# Altium project mcudevkit.PrjPcb (part 2 of 3)

## Sheet Usb to Uart.SchDoc
size A4; SheetNumber: 8; SheetTotal: 22
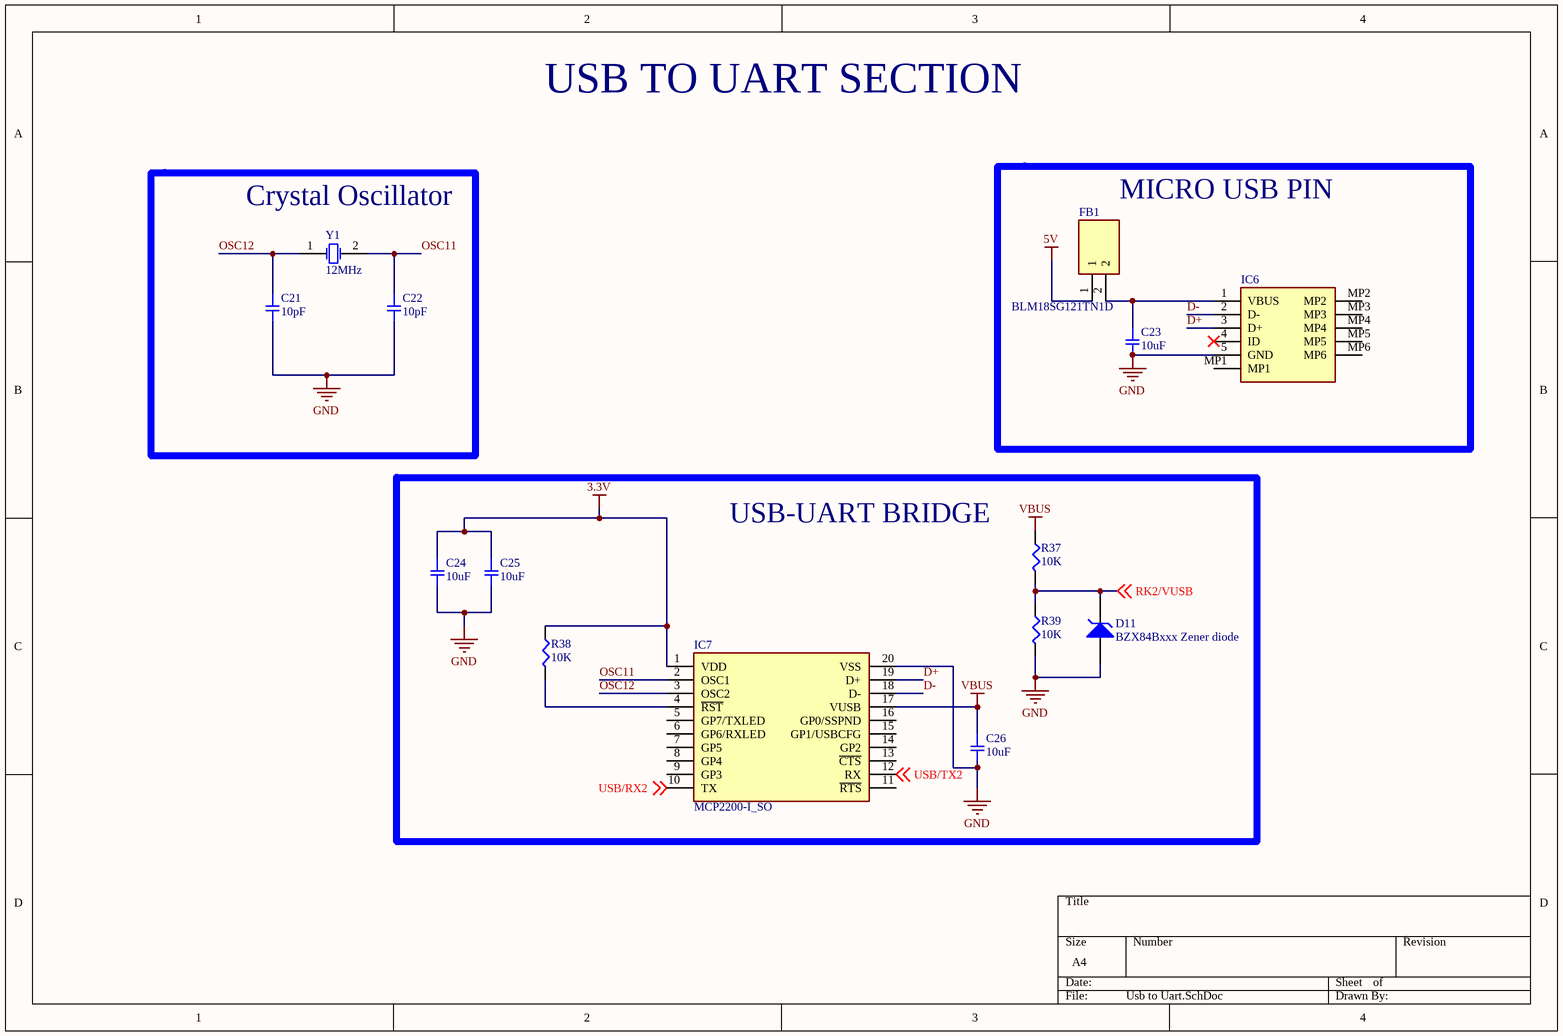
[diagram p7: Usb to Uart.SchDoc]

### Parts
C21  10pF  [SMD-0805C]
C22  10pF  [SMD-0805C]
C23  10uF  [SMD-0805C]
C24  10uF  [SMD-0805C]
C25  10uF  [SMD-0805C]
C26  10uF  [SMD-0805C]
D11  BZX84Bxxx Zener diode  [SOT95P240X120-3N]
FB1  BLM18SG121TN1D  [BLM18EG101TH1D]
IC6  (no value)  [0473461001]
IC7  MCP2200-I_SO  [SOIC127P1030X265-20N]
R37  10K  [SMD-0805-RES]
R38  10K  [SMD-0805-RES]
R39  10K  [SMD-0805-RES]
Y1  12MHz  [Mini Crystal]

### Blocks framed on the sheet
Crystal Oscillator: C21 C22 Y1
MICRO USB PIN: C23 FB1 IC6
USB-UART BRIDGE: C24-C26 D11 IC7 R37-R39

### Nets
3.3V: C24.1 C25.1 IC7.1(VDD) R38.1
5V: FB1.1
GND: C21.2 C22.2 C23.2 C24.2 C25.2 C26.2 D11.1(A) IC6.5(GND) IC7.20(VSS) R39.2
VBUS: C26.1 IC7.17(VUSB) R37.1
D+: IC6.3(D+) IC7.19(D+)
D-: IC6.2(D-) IC7.18(D-)
OSC11: C22.1 IC7.2(OSC1) Y1.2(X2)
OSC12: C21.1 IC7.3(OSC2) Y1.1(X1)
RK2/VUSB: D11.3(K) R37.2 R39.1 ; off-sheet RK2/VUSB
USB/RX2: IC7.10(TX) ; off-sheet USB/RX2
USB/TX2: IC7.12(RX) ; off-sheet USB/TX2
NetC23_1: C23.1 FB1.2 IC6.1(VBUS)
NetIC7_4: IC7.4(~{RST}) R38.2

Not connected (* = marked no-connect by the designer): IC6 4(ID)* MP1 MP2 MP3 MP4 MP5 MP6; IC7 5(GP7/TXLED) 6(GP6/RXLED) 7(GP5) 8(GP4) 9(GP3) 11(~{RTS}) 13(~{CTS}) 14(GP2) 15(GP1/USBCFG) 16(GP0/SSPND)

### Notes on the sheet
- USB TO UART SECTION

### Library data of the parts
C21-C26 = GCD21BR71H104KA01L: CAP CER 0.1UF 50V X7R 0805; Manufacturer: Murata Electronics North America; Factory Stock: 0; Unit Price (USD): 0.24; Minimum Quantity: 1; Value: 0.10µF; Tolerance: ±10%; Datasheets: http://www.murata.com/~/media/webrenewal/support/library/catalog/products/capacitor/mlcc/c03e.ashx; Image: //media.digikey.com/Renders/Murata%20Renders/0805%28GxM6%29.jpg; Digi-Key Part Number: 490-11955-1-ND; Part Number: GCD21BR71H104KA01L; Quantity Available: 157; @ qty: 0; Packaging: Cut Tape (CT); Series: GCD; Part Status: Active; Voltage: 50V; Temperature Coefficient: X7R; Operating Temperature: -55°C ~ 125°C; Features: -; Ratings: AEC-Q200; Applications: Automotive; Mounting Type: Surface Mount, MLCC; Package / Case: 0805 (2012 Metric); Size / Dimension: 0.079" L x 0.049" W (2.00mm x 1.25mm); Height - Seated (Max): -; Thickness (Max): 0.049" (1.25mm); Lead Spacing: -; Lead Style: -
D11 = BZX84Bxxx Zener diode: BZX84Bxxx SMD Zener Diode SOT-23
FB1 = BLM18SG121TN1D: Ferrite Bead; Manufacturer_Name: Murata Electronics; Datasheet Link: http://www.murata.com/~/media/webrenewal/support/library/catalog/products/emc/emifil/c31e.ashx?la=en-gb; Height: 0.75mm; Manufacturer_Part_Number: BLM18SG121TN1D; Mouser Part Number: 81-BLM18SG121TN1D; Mouser Price/Stock: https://www.mouser.co.uk/ProductDetail/Murata-Electronics/BLM18SG121TN1D?qs=OMB6gcCnelWdy%252B7xRA0fBw%3D%3D; Arrow Part Number: BLM18SG121TN1D; Arrow Price/Stock: https://www.arrow.com/en/products/blm18sg121tn1d/murata-manufacturing?region=nac
IC6 = 0473461001: Connector; Manufacturer_Name: Molex; Datasheet Link: https://componentsearchengine.com/Datasheets/1/0473461001.pdf; Height: 2.45mm; Manufacturer_Part_Number: 0473461001; Mouser Part Number: N/A; Mouser Price/Stock: https://www.mouser.co.uk/ProductDetail/Molex/0473461001?qs=2bnkQPT%252BPafTZgGVt%2FOGfA%3D%3D; Arrow Part Number: 0473461001; Arrow Price/Stock: https://www.arrow.com/en/products/0473461001/molex?region=nac
IC7 = MCP2200-I_SO: Integrated Circuit; Manufacturer_Name: Microchip; Manufacturer_Part_Number: MCP2200-I/SO; Datasheet Link: https://datasheet.datasheetarchive.com/originals/distributors/Datasheets-DGA2/214544.pdf; Height: 2.65mm; Mouser Part Number: 579-MCP2200-I/SO; Mouser Price/Stock: https://www.mouser.co.uk/ProductDetail/Microchip-Technology-Atmel/MCP2200-I-SO?qs=kI7nsUnms46fN8L9VZlJCA%3D%3D; Arrow Part Number: MCP2200-I/SO; Arrow Price/Stock: https://www.arrow.com/en/products/mcp2200-iso/microchip-technology?region=nac
R37-R39 = ERJ-6ENF1001V: RES SMD 1K OHM 1% 1/8W 0805; Manufacturer: Panasonic Electronic Components; Factory Stock: 0; Unit Price (USD): 0.00729; @ qty: 1500; Minimum Quantity: 1; Power (Watts): 0.125W, 1/8W; Temperature Coefficient: ±100ppm/°C; Part Number: ERJ-6ENF1001V; Datasheets: http://industrial.panasonic.com/www-cgi/jvcr13pz.cgi?E+PZ+3+AOA0002+ERJ6ENF1001V+7+WW; Image: //media.digikey.com/Renders/Panasonic%20Renders/ERJ-0805%20Pkg.jpg; Digi-Key Part Number: P1.00KCCT-ND; Quantity Available: 12895103; Packaging: Cut Tape (CT); Series: ERJ; Part Status: Active; Value: 1k; Tolerance: ±1%; Composition: Thick Film; Features: Automotive AEC-Q200; Operating Temperature: -55°C ~ 155°C; Package / Case: 0805 (2012 Metric); Supplier Device Package: 0805; Size / Dimension: 0.079" L x 0.049" W (2.00mm x 1.25mm); Height - Seated (Max): 0.028" (0.70mm); Number of Terminations: 2; Failure Rate: -
Y1 = Mini Crystal: 9B-64.000MBBK-B; Manufacturer: Abracon; PartNumber: ABLS2-4.096MHZ-D4Y-T; Operation Mode: Fundamental or 3rd Overtone; Shunt Capacitance: 7 pF Max.; Freq. Stability: +/- 30 ppm; Packing: Tape and Reel; ESR: 180 Ohm; Load Capacitance: 18 pF; Frequency: 4.096 MHz; Mounting Technology: Surface Mount; PackageDescription: 2-Pin SMD, Body 11.4 x 4.7 mm, Height 3.3 mm; ComponentLink1URL: http://www.abracon.com/; ComponentLink2Description: Datasheet; Operating Temp. Range: -40 to 85 degC; RoHS: TRUE; PackageReference: ABLS2-2; DatasheetVersion: Rev. 03.31.11; Freq. Tolerance: +/- 30 ppm; ComponentLink2URL: http://www.abracon.com/Resonators/ABLS2.pdf; ComponentLink1Description: Manufacturer URL

## Sheet SPI FLASH.SchDoc
size Letter; SheetNumber: 9; SheetTotal: 22
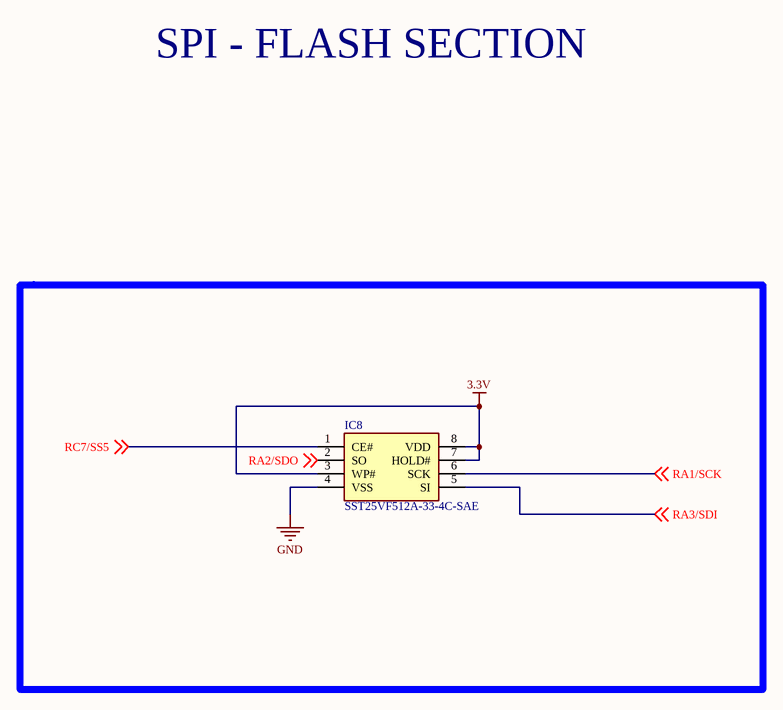
[diagram p8: SPI FLASH.SchDoc]

### Parts
IC8  SST25VF512A-33-4C-SAE  [SOIC127P600X175-8N]

### Nets
3.3V: IC8.3(WP#) IC8.7(HOLD#) IC8.8(VDD)
GND: IC8.4(VSS)
RA1/SCK: IC8.6(SCK) ; off-sheet RA1/SCK
RA2/SDO: IC8.2(SO) ; off-sheet RA2/SDO
RA3/SDI: IC8.5(SI) ; off-sheet RA3/SDI
RC7/SS5: IC8.1(CE#) ; off-sheet RC7/SS5

### Notes on the sheet
- SPI - FLASH SECTION

### Library data of the parts
IC8 = SST25VF512A-33-4C-SAE: Integrated Circuit; Manufacturer_Name: Microchip; Datasheet Link: http://ww1.microchip.com/downloads/en/DeviceDoc/25090A.pdf; Height: 1.75mm; Manufacturer_Part_Number: SST25VF512A-33-4C-SAE; Mouser Part Number: 804-25VF512A3CSAE; Mouser Price/Stock: https://www.mouser.co.uk/ProductDetail/Microchip-Technology/SST25VF512A-33-4C-SAE?qs=sPPKN8MmjErx4W822Eh6pg%3D%3D; Arrow Part Number: SST25VF512A-33-4C-SAE; Arrow Price/Stock: https://www.arrow.com/en/products/sst25vf512a-33-4c-sae/microchip-technology?region=nac

## Sheet RS-485.SchDoc
size A4; SheetNumber: 10; SheetTotal: 22
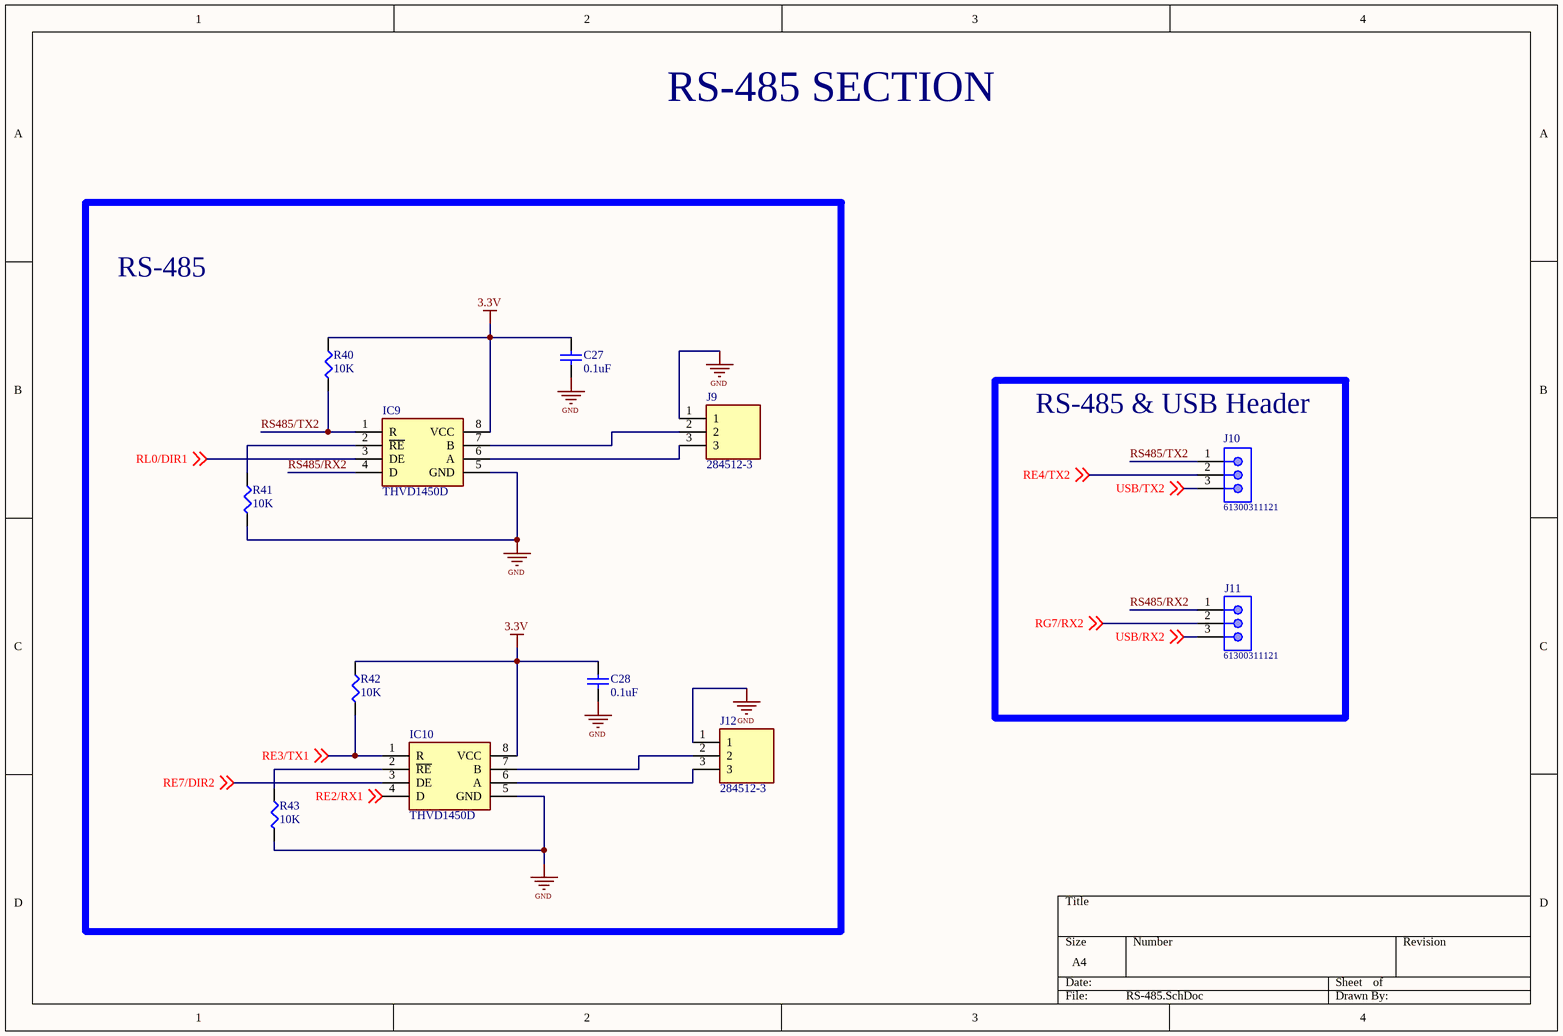
[diagram p9: RS-485.SchDoc]

### Parts
C27  value 0.1uF  [C1206]  (hidden comment: 10pF)
C28  value 0.1uF  [C1206]  (hidden comment: 10pF)
IC9  THVD1450D  [SOIC127P600X175-8N]
IC10  THVD1450D  [SOIC127P600X175-8N]
J9  284512-3  [SHDRRA3W80P0X350_1X3_1250X920X745P]
J10  61300311121  [61300311121]
J11  61300311121  [61300311121]
J12  284512-3  [SHDRRA3W80P0X350_1X3_1250X920X745P]
R40  10K  [SMD-0805-RES]
R41  10K  [SMD-0805-RES]
R42  10K  [SMD-0805-RES]
R43  10K  [SMD-0805-RES]

### Blocks framed on the sheet
RS-485: C27 C28 IC9 IC10 J9 J12 R40-R43
RS-485 & USB Header: J10 J11

### Nets
3.3V: C27.2 C28.2 IC9.8(VCC) IC10.8(VCC) R40.1 R42.1
GND: C27.1 C28.1 IC9.5(GND) IC10.5(GND) J9.1 J12.1 R41.2 R43.2
RE2/RX1: IC10.4(D) ; off-sheet RE2/RX1
RE3/TX1: IC10.1(R) R42.2 ; off-sheet RE3/TX1
RE4/TX2: J10.2 ; off-sheet RE4/TX2
RE7/DIR2: IC10.3(DE) ; off-sheet RE7/DIR2
RG7/RX2: J11.2 ; off-sheet RG7/RX2
RL0/DIR1: IC9.3(DE) ; off-sheet RL0/DIR1
RS485/RX2: IC9.4(D) J11.1
RS485/TX2: IC9.1(R) J10.1 R40.2
USB/RX2: J11.3 ; off-sheet USB/RX2
USB/TX2: J10.3 ; off-sheet USB/TX2
NetIC9_2: IC9.2(~{RE}) R41.1
NetIC9_6: IC9.6(A) J9.3
NetIC9_7: IC9.7(B) J9.2
NetIC10_2: IC10.2(~{RE}) R43.1
NetIC10_6: IC10.6(A) J12.3
NetIC10_7: IC10.7(B) J12.2

### Notes on the sheet
- RS-485 SECTION

### Library data of the parts
C27 C28 = Cap Semi: Capacitor (Semiconductor SIM Model); PART NUMBER: C0603C100M5HACTU; Published: 8-Jun-2000; LatestRevisionDate: 29-May-2009; LatestRevisionNote: IPC-7351 Footprint Added.; PackageReference: C1206; Publisher: Altium Limited; PackageDescription: Chip Capacitor; Source: Mouser
IC9 IC10 = THVD1450D: Integrated Circuit; Manufacturer_Name: Texas Instruments; Datasheet Link: http://www.ti.com/lit/gpn/THVD1450; Height: 1.75mm; Manufacturer_Part_Number: THVD1450D; Mouser Part Number: 595-THVD1450D; Mouser Price/Stock: https://www.mouser.co.uk/ProductDetail/Texas-Instruments/THVD1450D?qs=chTDxNqvsylemUKR9F4kpw%3D%3D; Arrow Part Number: THVD1450D; Arrow Price/Stock: https://www.arrow.com/en/products/thvd1450d/texas-instruments?region=nac
J9 J12 = 284512-3: Connector; Manufacturer_Name: TE Connectivity; Datasheet Link: https://www.te.com/commerce/DocumentDelivery/DDEController?Action=showdoc&DocId=Customer+Drawing%7F284512%7FE4%7Fpdf%7FEnglish%7FENG_CD_284512_E4.pdf%7F284512-3; Height: 7.45mm; Manufacturer_Part_Number: 284512-3; Mouser Part Number: 571-284512-3; Mouser Price/Stock: https://www.mouser.co.uk/ProductDetail/TE-Connectivity/284512-3?qs=woBvfblj%2Fzwah7g8QvojCQ%3D%3D; Arrow Part Number: 284512-3; Arrow Price/Stock: https://www.arrow.com/en/products/284512-3/te-connectivity?region=nac
J10 J11 = 61300311121: WR-PHD Pin Header, THT, pitch 2.54mm, Single Row, Vertical, 3pin; Pin Number: 3; Gender: Male; Rated Current: 3A; Working Voltage: 250VAC; Withstanding Voltage: 500VAC; Contact Resistance: 20mOhm; ComponentLink1Description: Manufacturer; ComponentLink1URL: http://www.we-online.de; ComponentLink2Description: Datasheet; ComponentLink2URL: https://katalog.we-online.de/em/datasheet/6130xx11121.pdf; Part Number: 61300311121; Published Date: June 2019; Publisher: Wurth Elektronik; Pitch: 2.54mm; Operating Temperature: -40 to +105degC; Mounting Technology: THT; Packaging: Bag; Row Number: Single; Orientation: Vertical
R40-R43 = ERJ-6ENF1001V: as R37 on sheet Usb to Uart; Part Number: ERJ-6ENF1001V; Datasheets: http://industrial.panasonic.com/www-cgi/jvcr13pz.cgi?E+PZ+3+AOA0002+ERJ6ENF1001V+7+WW; Image: //media.digikey.com/Renders/Panasonic%20Renders/ERJ-0805%20Pkg.jpg; Digi-Key Part Number: P1.00KCCT-ND; Quantity Available: 12895103; Packaging: Cut Tape (CT); Series: ERJ; Part Status: Active; Value: 1k; Tolerance: ±1%; Composition: Thick Film; Features: Automotive AEC-Q200; Operating Temperature: -55°C ~ 155°C; Package / Case: 0805 (2012 Metric); Supplier Device Package: 0805; Size / Dimension: 0.079" L x 0.049" W (2.00mm x 1.25mm); Height - Seated (Max): 0.028" (0.70mm); Number of Terminations: 2; Failure Rate: -

## Sheet DAC SPI.SchDoc
size Letter; SheetNumber: 11; SheetTotal: 22
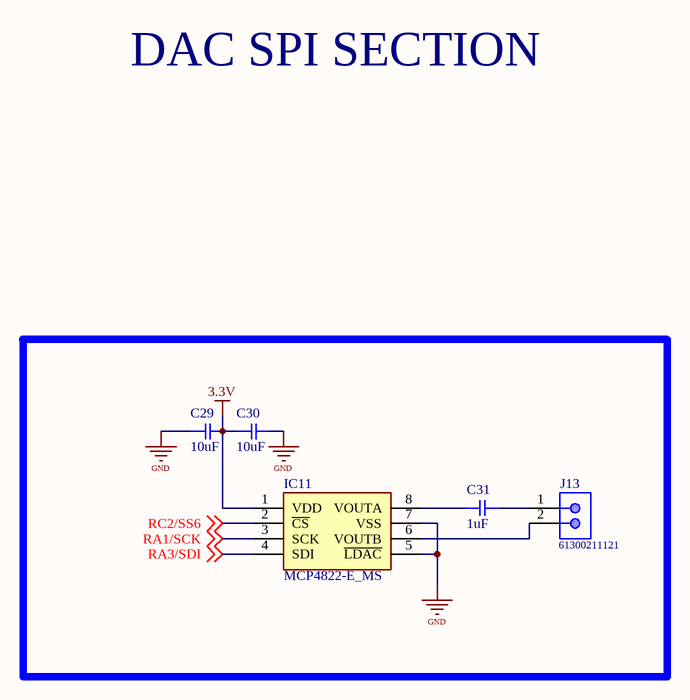
[diagram p10: DAC SPI.SchDoc]

### Parts
C29  10uF  [SMD-0805C]
C30  10uF  [SMD-0805C]
C31  1uF  [SMD-0805C]
IC11  MCP4822-E_MS  [SOP65P490X110-8N]
J13  61300211121  [61300211121]

### Nets
3.3V: C29.2 C30.1 IC11.1(VDD)
GND: C29.1 C30.2 IC11.5(~{LDAC}) IC11.7(VSS)
RA1/SCK: IC11.3(SCK) ; off-sheet RA1/SCK
RA3/SDI: IC11.4(SDI) ; off-sheet RA3/SDI
RC2/SS6: IC11.2(~{CS}) ; off-sheet RC2/SS6
NetC31_1: C31.1 J13.1
NetC31_2: C31.2 IC11.8(VOUTA)
NetIC11_6: IC11.6(VOUTB) J13.2

### Notes on the sheet
- DAC SPI SECTION

### Library data of the parts
C29-C31 = GCD21BR71H104KA01L: as C21 on sheet Usb to Uart; Datasheets: http://www.murata.com/~/media/webrenewal/support/library/catalog/products/capacitor/mlcc/c03e.ashx; Image: //media.digikey.com/Renders/Murata%20Renders/0805%28GxM6%29.jpg; Digi-Key Part Number: 490-11955-1-ND; Part Number: GCD21BR71H104KA01L; Quantity Available: 157; @ qty: 0; Packaging: Cut Tape (CT); Series: GCD; Part Status: Active; Voltage: 50V; Temperature Coefficient: X7R; Operating Temperature: -55°C ~ 125°C; Features: -; Ratings: AEC-Q200; Applications: Automotive; Mounting Type: Surface Mount, MLCC; Package / Case: 0805 (2012 Metric); Size / Dimension: 0.079" L x 0.049" W (2.00mm x 1.25mm); Height - Seated (Max): -; Thickness (Max): 0.049" (1.25mm); Lead Spacing: -; Lead Style: -
IC11 = MCP4822-E_MS: Integrated Circuit; Manufacturer_Name: Microchip; Manufacturer_Part_Number: MCP4822-E/MS; Datasheet Link: https://datasheet.datasheetarchive.com/originals/distributors/Datasheets-DGA17/911642.pdf; Height: 1.1mm; Mouser Part Number: 579-MCP4822-E/MS; Mouser Price/Stock: https://www.mouser.co.uk/ProductDetail/Microchip-Technology/MCP4822-E-MS?qs=usxtMOJb1Rzc5xsp0Zr6iQ%3D%3D; Arrow Part Number: MCP4822-E/MS; Arrow Price/Stock: https://www.arrow.com/en/products/mcp4822-ems/microchip-technology?region=europe
J13 = 61300211121: WR-PHD Pin Header, THT, pitch 2.54mm, Single Row, Vertical, 2pin; Pin Number: 2; Gender: Male; Rated Current: 3A; Working Voltage: 250VAC; Withstanding Voltage: 500VAC; Contact Resistance: 20mOhm; ComponentLink1Description: Manufacturer; ComponentLink1URL: http://www.we-online.de; ComponentLink2Description: Datasheet; ComponentLink2URL: https://katalog.we-online.de/em/datasheet/6130xx11121.pdf; Part Number: 61300211121; Published Date: June 2019; Publisher: Wurth Elektronik; Pitch: 2.54mm; Operating Temperature: -40 to +105degC; Mounting Technology: THT; Packaging: Bag; Row Number: Single; Orientation: Vertical

## Sheet Lan.SchDoc
size A3; SheetNumber: 12; SheetTotal: 22
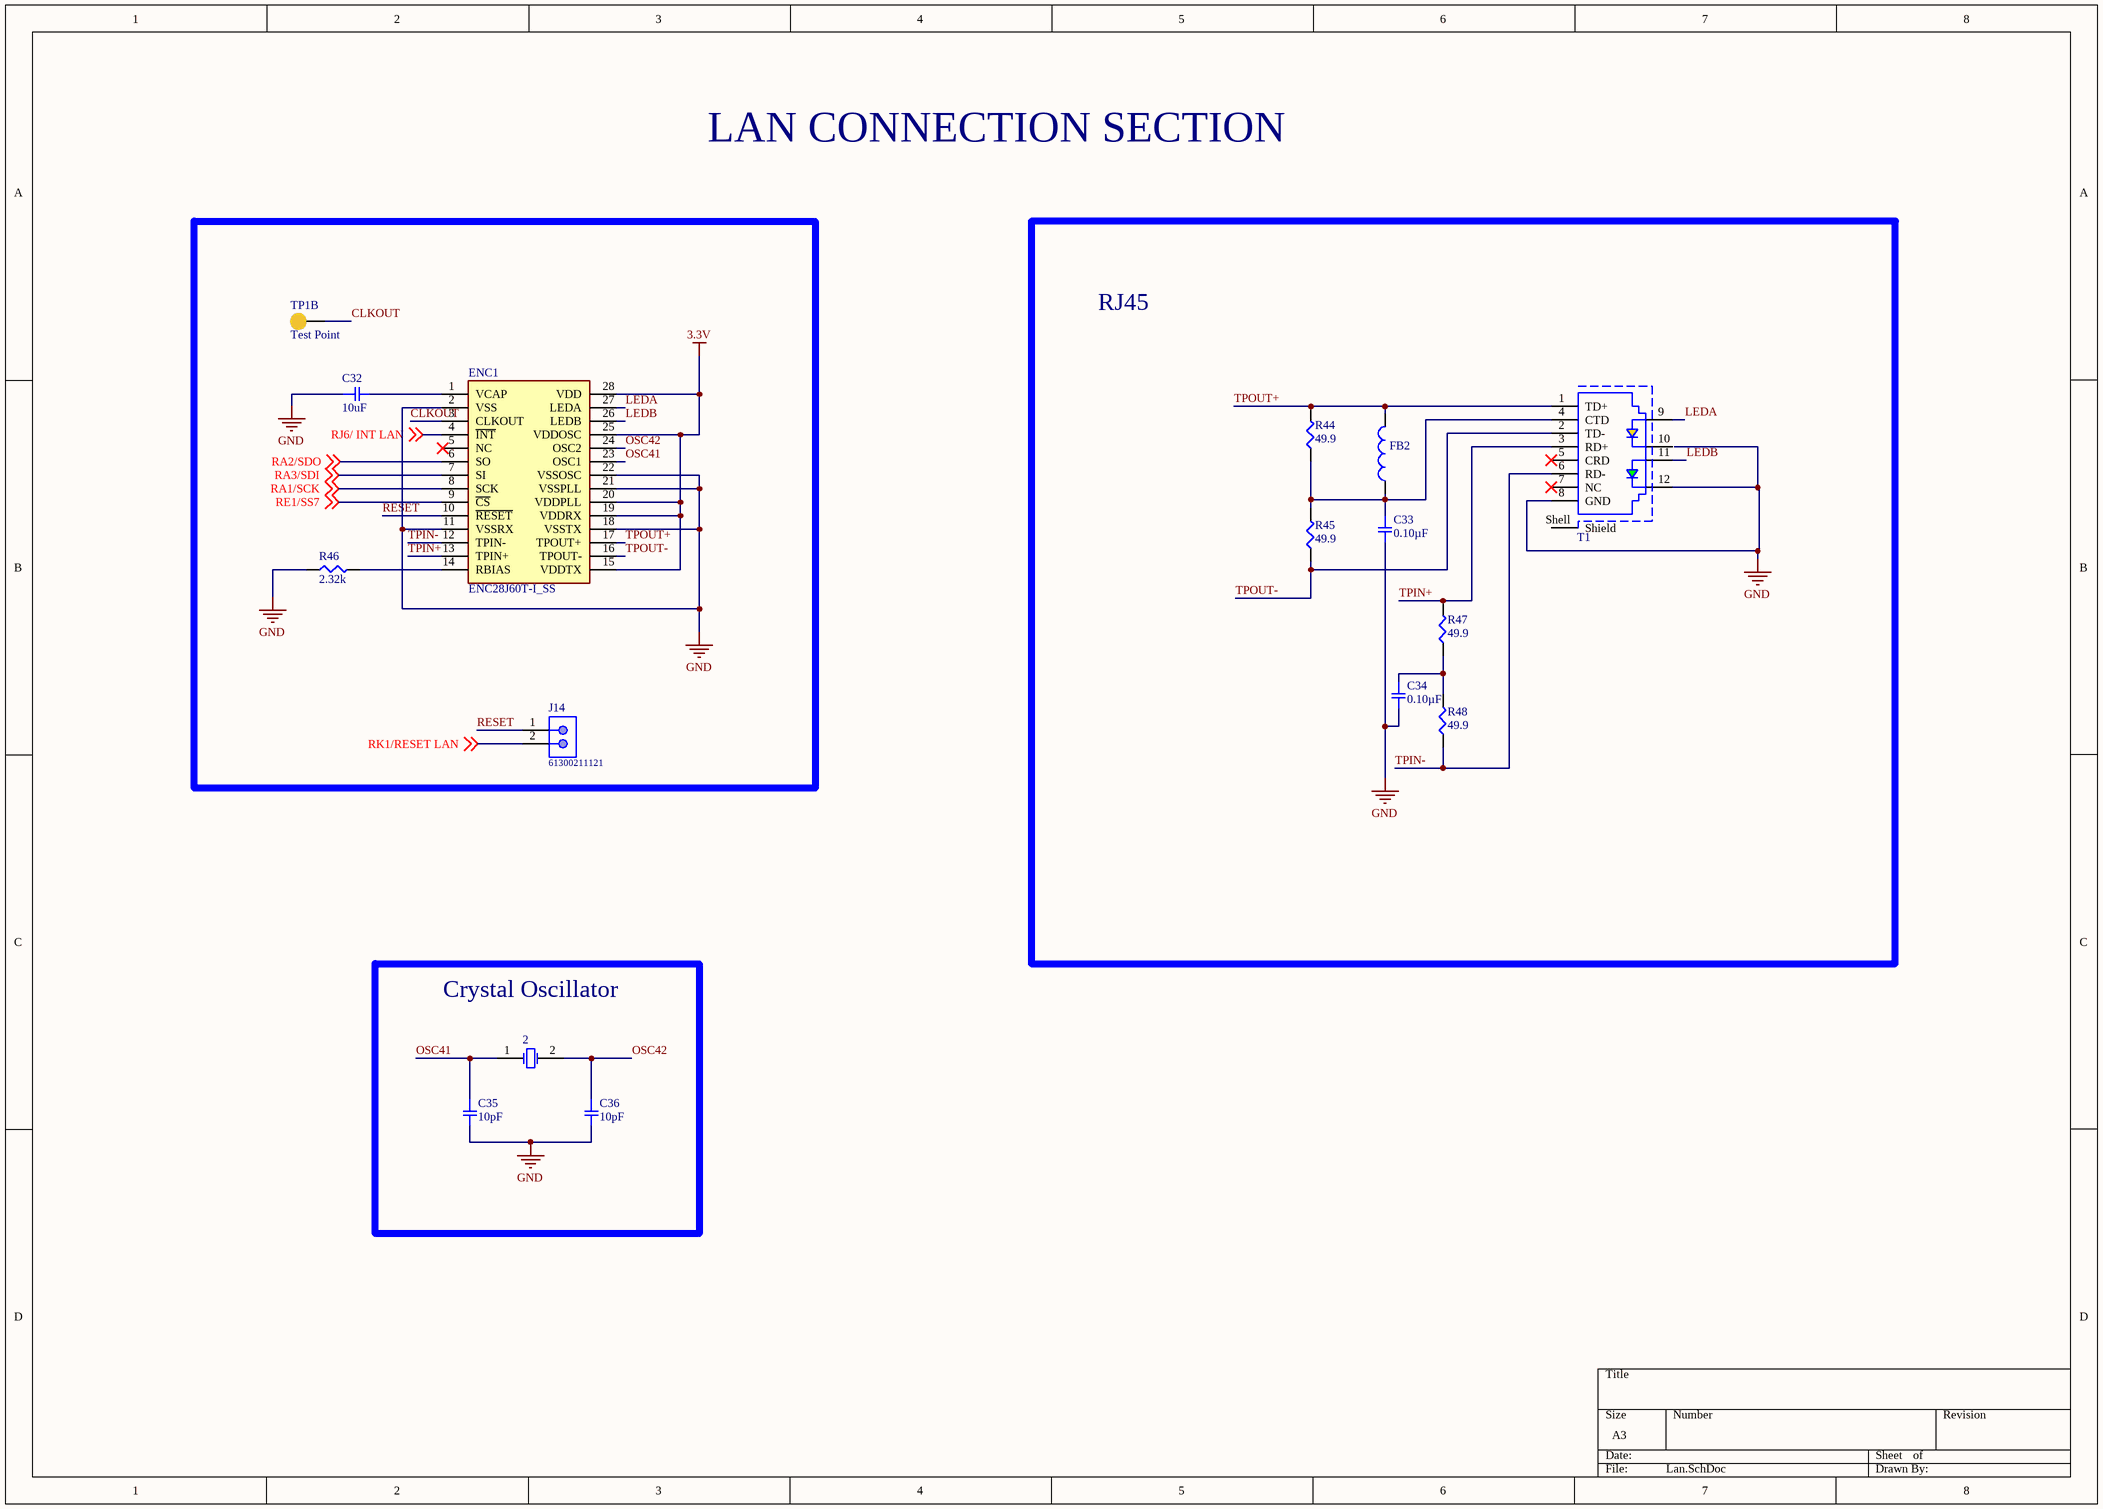
[diagram p11: Lan.SchDoc]

### Parts
2  (no value)  [Mini Crystal]
C32  10uF  [SMD-0805C]
C33  0.10µF  [SMD-0805C]
C34  0.10µF  [SMD-0805C]
C35  10pF  [SMD-0805C]
C36  10pF  [SMD-0805C]
ENC1  ENC28J60T-I_SS  [SOP65P780X200-28N]
FB2  320Ohm  [WE-MPSA_0805_L2W1.2H0.9]  (value not drawn)
J14  61300211121  [61300211121]
R44  49.9  [SMD-0805-RES]
R45  49.9  [SMD-0805-RES]
R46  2.32k  [SMD-0805-RES]
R47  49.9  [SMD-0805-RES]
R48  49.9  [SMD-0805-RES]
T1  ARJM11D7-009-AB-EW2  [74990111211]  (value not drawn)
TP1  Test Point  [pad2]  (part B of 2)

### Blocks framed on the sheet
RJ45: C33 C34 FB2 R44 R45 R47 R48 T1
Crystal Oscillator: 2 C35 C36

### Nets
3.3V: ENC1.15(VDDTX) ENC1.19(VDDRX) ENC1.20(VDDPLL) ENC1.25(VDDOSC) ENC1.28(VDD)
GND: C32.1 C33.2 C34.2 C35.2 C36.2 ENC1.2(VSS) ENC1.11(VSSRX) ENC1.18(VSSTX) ENC1.21(VSSPLL) ENC1.22(VSSOSC) R46.1 T1.8(GND) T1.12
CLKOUT: ENC1.3(CLKOUT) TP1.1
LEDA: ENC1.27(LEDA) T1.9
LEDB: ENC1.26(LEDB) T1.11
OSC41: 2.1(X1) C35.1 ENC1.23(OSC1)
OSC42: 2.2(X2) C36.1 ENC1.24(OSC2)
RA1/SCK: ENC1.8(SCK) ; off-sheet RA1/SCK
RA2/SDO: ENC1.6(SO) ; off-sheet RA2/SDO
RA3/SDI: ENC1.7(SI) ; off-sheet RA3/SDI
RE1/SS7: ENC1.9(~{CS}) ; off-sheet RE1/SS7
RESET: ENC1.10(~{RESET}) J14.1
RJ6/ INT LAN: ENC1.4(~{INT}) ; off-sheet RJ6/ INT LAN
RK1/RESET LAN: J14.2 ; off-sheet RK1/RESET LAN
TPIN+: ENC1.13(TPIN+) R47.2 T1.3(RD+)
TPIN-: ENC1.12(TPIN-) R48.1 T1.6(RD-)
TPOUT+: ENC1.17(TPOUT+) FB2.2 R44.2 T1.1(TD+)
TPOUT-: ENC1.16(TPOUT-) R45.1 T1.2(TD-)
NetC32_2: C32.2 ENC1.1(VCAP)
NetC33_1: C33.1 FB2.1 R44.1 R45.2 T1.4(CTD)
NetC34_1: C34.1 R47.1 R48.2
NetENC1_14: ENC1.14(RBIAS) R46.2

Not connected (* = marked no-connect by the designer): ENC1 5(NC); T1 5(CRD)* 7(NC)* 10 Shell(Shield)

### Notes on the sheet
- LAN CONNECTION SECTION

### Library data of the parts
2 = Mini Crystal: as Y1 on sheet Usb to Uart; Mounting Technology: Surface Mount; PackageDescription: 2-Pin SMD, Body 11.4 x 4.7 mm, Height 3.3 mm; ComponentLink1URL: http://www.abracon.com/; ComponentLink2Description: Datasheet; Operating Temp. Range: -40 to 85 degC; RoHS: TRUE; PackageReference: ABLS2-2; DatasheetVersion: Rev. 03.31.11; Freq. Tolerance: +/- 30 ppm; ComponentLink2URL: http://www.abracon.com/Resonators/ABLS2.pdf; ComponentLink1Description: Manufacturer URL
C32 C35 C36 = GCD21BR71H104KA01L: as C21 on sheet Usb to Uart; Datasheets: http://www.murata.com/~/media/webrenewal/support/library/catalog/products/capacitor/mlcc/c03e.ashx; Image: //media.digikey.com/Renders/Murata%20Renders/0805%28GxM6%29.jpg; Digi-Key Part Number: 490-11955-1-ND; Part Number: GCD21BR71H104KA01L; Quantity Available: 157; @ qty: 0; Packaging: Cut Tape (CT); Series: GCD; Part Status: Active; Voltage: 50V; Temperature Coefficient: X7R; Operating Temperature: -55°C ~ 125°C; Features: -; Ratings: AEC-Q200; Applications: Automotive; Mounting Type: Surface Mount, MLCC; Package / Case: 0805 (2012 Metric); Size / Dimension: 0.079" L x 0.049" W (2.00mm x 1.25mm); Height - Seated (Max): -; Thickness (Max): 0.049" (1.25mm); Lead Spacing: -; Lead Style: -
C33 C34 = GCD21BR71H104KA01L: CAP CER 0.1UF 50V X7R 0805; Manufacturer: Murata Electronics North America; Factory Stock: 0; Unit Price (USD): 0.24; Minimum Quantity: 1; Tolerance: ±10%; Datasheets: http://www.murata.com/~/media/webrenewal/support/library/catalog/products/capacitor/mlcc/c03e.ashx; Image: //media.digikey.com/Renders/Murata%20Renders/0805%28GxM6%29.jpg; Digi-Key Part Number: 490-11955-1-ND; Part Number: GCD21BR71H104KA01L; Quantity Available: 157; @ qty: 0; Packaging: Cut Tape (CT); Series: GCD; Part Status: Active; Value: 0.10µF; Voltage: 50V; Temperature Coefficient: X7R; Operating Temperature: -55°C ~ 125°C; Features: -; Ratings: AEC-Q200; Applications: Automotive; Mounting Type: Surface Mount, MLCC; Package / Case: 0805 (2012 Metric); Size / Dimension: 0.079" L x 0.049" W (2.00mm x 1.25mm); Height - Seated (Max): -; Thickness (Max): 0.049" (1.25mm); Lead Spacing: -; Lead Style: -
ENC1 = ENC28J60T-I_SS: Integrated Circuit; Manufacturer_Name: Microchip; Manufacturer_Part_Number: ENC28J60T-I/SS; Datasheet Link: https://mouser.componentsearchengine.com/Datasheets/2/ENC28J60T-I_SS.pdf; Height: 2mm; Mouser Part Number: 579-ENC28J60T-I/SS; Mouser Price/Stock: https://www.mouser.co.uk/ProductDetail/Microchip-Technology/ENC28J60T-I-SS?qs=0swJU7D5CoWRYqX2omYpJQ%3D%3D; Arrow Part Number: ENC28J60T-I/SS; Arrow Price/Stock: https://www.arrow.com/en/products/enc28j60t-iss/microchip-technology?region=nac
FB2 = 78279220321: WE-MPSA EMI Multilayer Power Suppresion Bead, size 0805, 320Ohm, 2.5A; Manufacturer: Wurth Elektronik; Case/Size Code: 0805; DC Resistance: 50mOhm; Impedance Max: 347Ohm; Type: High Current; Manufacturer Part Number: 78279220321; Category: Ferrites for PCB Assembly; Match Code: WE-MPSA; ComponentLink1Description: Website Link; ComponentLink1URL: https://www.we-online.com/redexpert/article/78279220321?ad; ComponentLink2Description: Datasheet Link; ComponentLink2URL: https://www.we-online.com/redexpert/spec/78279220321?ad; Mount: Surface Mount; Operating Temperature Max: 125°C; Operating Temperature Min: -55°C; Packaging: Tape and Reel; Length: 2mm; Width: 1.2mm; Height: 0.9mm; Automotive: Yes; Impedance @100MHz: 320Ohm; Rated Current: 2.5A; ComponentLink3Description: digikey; ComponentLink3URL: https://www.digikey.in/en/products/detail/laird-signal-integrity-products/MI0805L301R-10/806630
J14 = 61300211121: as J13 on sheet DAC SPI; ComponentLink1Description: Manufacturer; ComponentLink1URL: http://www.we-online.de; ComponentLink2Description: Datasheet; ComponentLink2URL: https://katalog.we-online.de/em/datasheet/6130xx11121.pdf; Part Number: 61300211121; Published Date: June 2019; Publisher: Wurth Elektronik; Pitch: 2.54mm; Operating Temperature: -40 to +105degC; Mounting Technology: THT; Packaging: Bag; Row Number: Single; Orientation: Vertical
R44 R45 R47 R48 = ERJ-6ENF49R9V: RES SMD 49.9 OHM 1% 1/8W 0805; Manufacturer: Panasonic Electronic Components; Factory Stock: 0; Unit Price (USD): 0.00729; @ qty: 1500; Minimum Quantity: 1; Power (Watts): 0.125W, 1/8W; Temperature Coefficient: ±100ppm/°C; Part Number: ERJ-6ENF49R9V; Datasheets: http://industrial.panasonic.com/www-cgi/jvcr13pz.cgi?E+PZ+3+AOA0002+ERJ6ENF49R9V+7+WW; Image: //media.digikey.com/Renders/Panasonic%20Renders/ERJ-0805%20Pkg.jpg; Digi-Key Part Number: P49.9CCT-ND; Quantity Available: 574999; Packaging: Cut Tape (CT); Series: ERJ; Part Status: Active; Value: 49.9; Tolerance: ±1%; Composition: Thick Film; Features: Automotive AEC-Q200; Operating Temperature: -55°C ~ 155°C; Package / Case: 0805 (2012 Metric); Supplier Device Package: 0805; Size / Dimension: 0.079" L x 0.049" W (2.00mm x 1.25mm); Height - Seated (Max): 0.028" (0.70mm); Number of Terminations: 2; Failure Rate: -
R46 = ERJ-6ENF2321V: RES SMD 2.32K OHM 1% 1/8W 0805; Manufacturer: Panasonic Electronic Components; Factory Stock: 0; Unit Price (USD): 0.00729; @ qty: 1500; Minimum Quantity: 1; Power (Watts): 0.125W, 1/8W; Temperature Coefficient: ±100ppm/°C; Part Number: ERJ-6ENF2321V; Datasheets: http://industrial.panasonic.com/www-cgi/jvcr13pz.cgi?E+PZ+3+AOA0002+ERJ6ENF2321V+7+WW; Image: //media.digikey.com/Renders/Panasonic%20Renders/ERJ-0805%20Pkg.jpg; Digi-Key Part Number: P2.32KCCT-ND; Quantity Available: 67004; Packaging: Cut Tape (CT); Series: ERJ; Part Status: Active; Value: 2.32k; Tolerance: ±1%; Composition: Thick Film; Features: Automotive AEC-Q200; Operating Temperature: -55°C ~ 155°C; Package / Case: 0805 (2012 Metric); Supplier Device Package: 0805; Size / Dimension: 0.079" L x 0.049" W (2.00mm x 1.25mm); Height - Seated (Max): 0.028" (0.70mm); Number of Terminations: 2; Failure Rate: -
T1 = 74990111211: WE-RJ45 LAN Transformer, THT, 1 Port, 10/100 Base-T, Tab Down; Manufacturer: Wurth Elektronik; LED: yellow-green; Number of Ports: 1; PoE: non-PoE; Shield Tabs: Yes; USB: No USB; Manufacturer Part Number: 74990111211; Category: Filtered Connectors; Match Code: WE-RJ45 LAN; ComponentLink1Description: Website Link; ComponentLink1URL: https://www.we-online.com/redexpert/article/74990111211?ad; ComponentLink2Description: Datasheet Link; ComponentLink2URL: https://www.we-online.com/redexpert/spec/74990111211?ad; Mount: Through Hole; Operating Temperature Max: 85°C; Operating Temperature Min: -40°C; Packaging: Tube; Length: 21.84mm; Width: 15.88mm; Height: 13.95mm; Data Rate: 10/100 Base-T; Tab: Down; ComponentLink3Description: Digikey Link; ComponentLink3URL: https://www.digikey.in/en/products/detail/abracon-llc/ARJM11D7-009-AB-EW2/7675229
TP1 = pad2: Top Testpoint Pad

## Sheet I2C EXTERNAL.SchDoc
size Letter; SheetNumber: 15; SheetTotal: 25
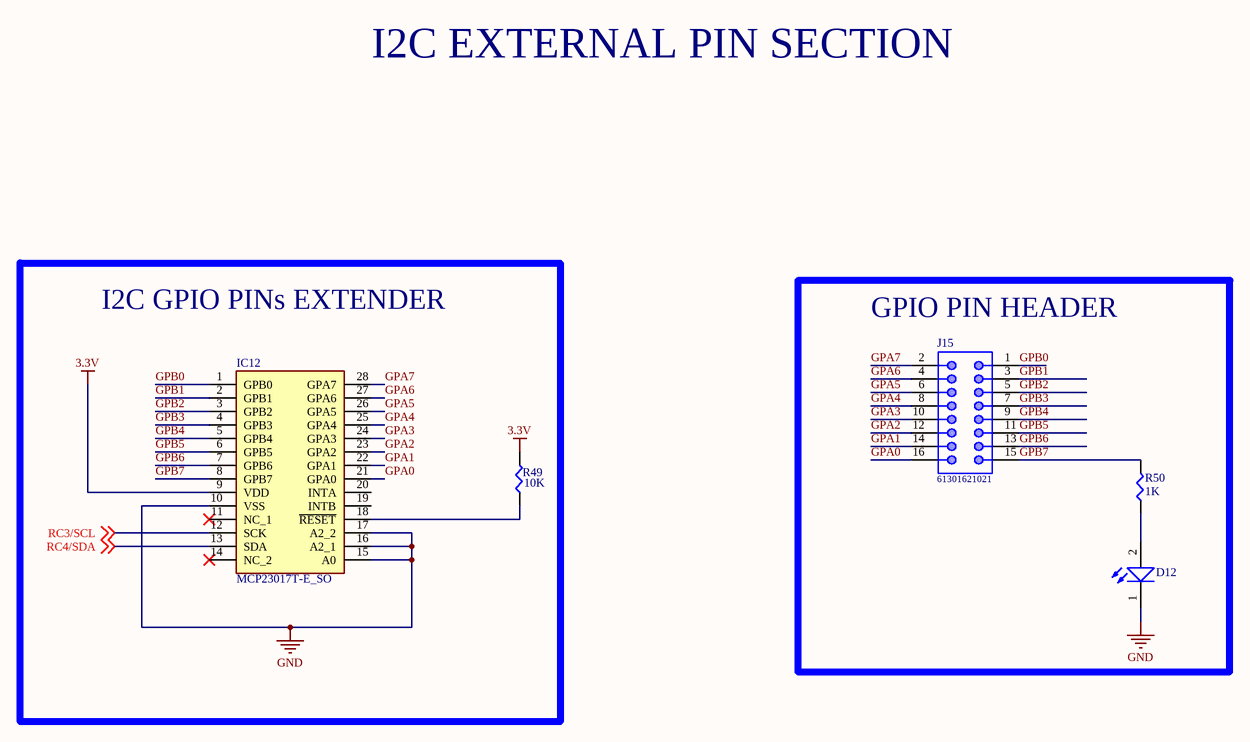
[diagram p12: I2C EXTERNAL.SchDoc]

### Parts
D12  150080BS75000  [WL-SMCW_0805]  (value not drawn)
IC12  MCP23017T-E_SO  [SOIC127P1030X265-28N]
J15  61301621021  [61301621021]
R49  10K  [SMD-0805-RES]
R50  1K  [SMD-0805-RES]

### Blocks framed on the sheet
I2C GPIO PINs EXTENDER: IC12 R49
GPIO PIN HEADER: D12 J15 R50

### Nets
3.3V: IC12.9(VDD) R49.2
GND: D12.1(K) IC12.10(VSS) IC12.15(A0) IC12.16(A2_1) IC12.17(A2_2)
GPA0: IC12.21(GPA0) J15.16
GPA1: IC12.22(GPA1) J15.14
GPA2: IC12.23(GPA2) J15.12
GPA3: IC12.24(GPA3) J15.10
GPA4: IC12.25(GPA4) J15.8
GPA5: IC12.26(GPA5) J15.6
GPA6: IC12.27(GPA6) J15.4
GPA7: IC12.28(GPA7) J15.2
GPB0: IC12.1(GPB0) J15.1
GPB1: IC12.2(GPB1) J15.3
GPB2: IC12.3(GPB2) J15.5
GPB3: IC12.4(GPB3) J15.7
GPB4: IC12.5(GPB4) J15.9
GPB5: IC12.6(GPB5) J15.11
GPB6: IC12.7(GPB6) J15.13
GPB7: IC12.8(GPB7) J15.15 R50.2
RC3/SCL: IC12.12(SCK) ; off-sheet RC3/SCL
RC4/SDA: IC12.13(SDA) ; off-sheet RC4/SDA
NetD12_2: D12.2(A) R50.1
NetIC12_18: IC12.18(~{RESET}) R49.1

Not connected (* = marked no-connect by the designer): IC12 11(NC_1)* 14(NC_2)* 19(INTB) 20(INTA)

### Notes on the sheet
- I2C EXTERNAL PIN SECTION

### Library data of the parts
D12 = 150080BS75000: WL-SMCW SMD Mono-color Chip LED Waterclear, size 0805, Blue; Forward Voltage: 3.2 V; Viewing Angle: 140°; Peak Wavelength: 465 nm; Published Date: Jan 2017; Publisher: Wurth Elektronik; ComponentLink1Description: Manufacturer; ComponentLink1URL: http://www.we-online.de; ComponentLink2Description: Datasheet; ComponentLink2URL: http://katalog.we-online.de/led/datasheet/150080BS75000.pdf; Part Number: 150080BS75000; Size: 0805; Emitting Color: Blue
IC12 = MCP23017T-E_SO: Integrated Circuit; Manufacturer_Name: Microchip; Manufacturer_Part_Number: MCP23017T-E/SO; Datasheet Link: http://ww1.microchip.com/downloads/en/DeviceDoc/20001952C.pdf; Height: 2.65mm; Mouser Part Number: 579-MCP23017T-E/SO; Mouser Price/Stock: https://www.mouser.co.uk/ProductDetail/Microchip-Technology/MCP23017T-E-SO?qs=usxtMOJb1RylPfT%252BJtgE3Q%3D%3D; Arrow Part Number: MCP23017T-E/SO; Arrow Price/Stock: https://www.arrow.com/en/products/mcp23017t-eso/microchip-technology?region=nac
J15 = 61301621021: WR-PHD Pin Header, THT, pitch 2.54mm, Dual Row, Angled, 16pin; Pin Number: 16; Gender: Male; Rated Current: 3A; Working Voltage: 250VAC; Withstanding Voltage: 500VAC; Contact Resistance: 20mOhm; ComponentLink1Description: Manufacturer; ComponentLink1URL: http://www.we-online.de; ComponentLink2Description: Datasheet; ComponentLink2URL: https://katalog.we-online.de/em/datasheet/6130xx21021.pdf; Part Number: 61301621021; Published Date: June 2019; Publisher: Wurth Elektronik; Pitch: 2.54mm; Operating Temperature: -40 to +105degC; Mounting Technology: THT; Packaging: Bag; Row Number: Dual; Orientation: Angled
R49 R50 = ERJ-6ENF1001V: as R37 on sheet Usb to Uart; Part Number: ERJ-6ENF1001V; Datasheets: http://industrial.panasonic.com/www-cgi/jvcr13pz.cgi?E+PZ+3+AOA0002+ERJ6ENF1001V+7+WW; Image: //media.digikey.com/Renders/Panasonic%20Renders/ERJ-0805%20Pkg.jpg; Digi-Key Part Number: P1.00KCCT-ND; Quantity Available: 12895103; Packaging: Cut Tape (CT); Series: ERJ; Part Status: Active; Value: 1k; Tolerance: ±1%; Composition: Thick Film; Features: Automotive AEC-Q200; Operating Temperature: -55°C ~ 155°C; Package / Case: 0805 (2012 Metric); Supplier Device Package: 0805; Size / Dimension: 0.079" L x 0.049" W (2.00mm x 1.25mm); Height - Seated (Max): 0.028" (0.70mm); Number of Terminations: 2; Failure Rate: -

## Sheet wwdt.SchDoc: WWDT
size Letter; SheetNumber: 14; SheetTotal: 22
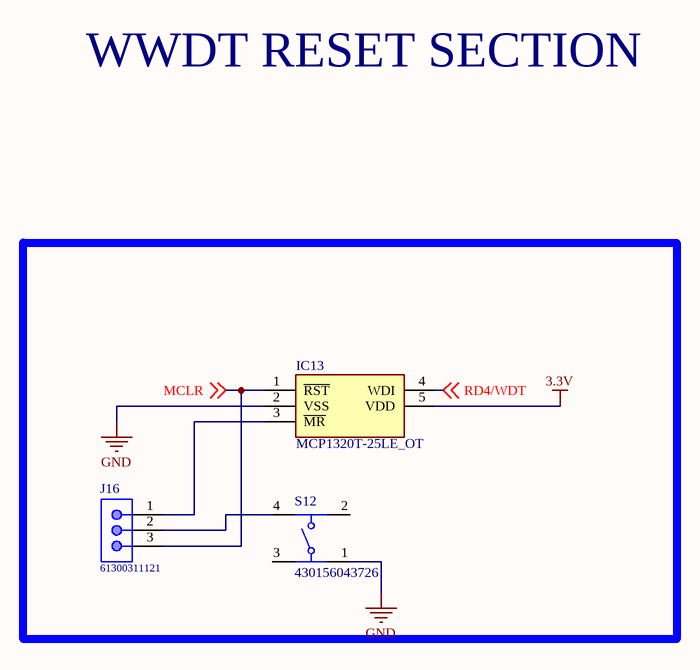
[diagram p13: wwdt.SchDoc]

### Parts
IC13  MCP1320T-25LE_OT  [SOT95P270X145-5N]
J16  61300311121  [61300311121]
S12  430156043726  [4301x60437x6]

### Nets
3.3V: IC13.5(VDD)
GND: IC13.2(VSS) S12.1
MCLR: IC13.1(~{RST}) J16.3 ; off-sheet MCLR
RD4/WDT: IC13.4(WDI) ; off-sheet RD4/WDT
NetIC13_3: IC13.3(~{MR}) J16.1
NetJ16_2: J16.2 S12.4

Not connected (* = marked no-connect by the designer): S12 2 3

### Notes on the sheet
- WWDT RESET SECTION

### Library data of the parts
IC13 = MCP1320T-25LE_OT: Integrated Circuit; Manufacturer_Name: Microchip; Manufacturer_Part_Number: MCP1320T-25LE/OT; Datasheet Link: https://www.arrow.com/en/products/mcp1320t-25leot/microchip-technology; Height: 1.45mm; Mouser Part Number: 579-MCP1320T-25LE/OT; Mouser Price/Stock: https://www.mouser.co.uk/ProductDetail/Microchip-Technology-Atmel/MCP1320T-25LE-OT?qs=Cv1v43EOJpq3RWxPEZurKg%3D%3D; Arrow Part Number: MCP1320T-25LE/OT; Arrow Price/Stock: https://www.arrow.com/en/products/mcp1320t-25leot/microchip-technology?region=nac
J16 = 61300311121: as J10 on sheet RS-485; ComponentLink1Description: Manufacturer; ComponentLink1URL: http://www.we-online.de; ComponentLink2Description: Datasheet; ComponentLink2URL: https://katalog.we-online.de/em/datasheet/6130xx11121.pdf; Part Number: 61300311121; Published Date: June 2019; Publisher: Wurth Elektronik; Pitch: 2.54mm; Operating Temperature: -40 to +105degC; Mounting Technology: THT; Packaging: Bag; Row Number: Single; Orientation: Vertical
S12 = 430156043726: WS-TATV THT Tact Switch 6x6mm, height 4.3mm, 260gf; Rated Voltage: 12VDC; Rated Current: 50mA; Washable: No; ComponentLink1Description: Manufacturer; ComponentLink1URL: http://www.we-online.de; ComponentLink2Description: Datasheet; ComponentLink2URL: https://katalog.we-online.com/em/datasheet/430156043726.pdf; Operating Temperature: -40 to +85degC; Part Number: 430156043726; Published Date: September 2019; Contact Material: Stainless Steel; Height: 4.3mm; Mounting Technology: THT; Contact Plating: Silver; Operation Force: 260gf; Packaging: Bulk; Terminal Material: Copper Alloy; Publisher: Wurth Elektronik; Terminal Plating: Silver

## Sheet CAN.SchDoc
size A; SheetNumber: 17; SheetTotal: 25
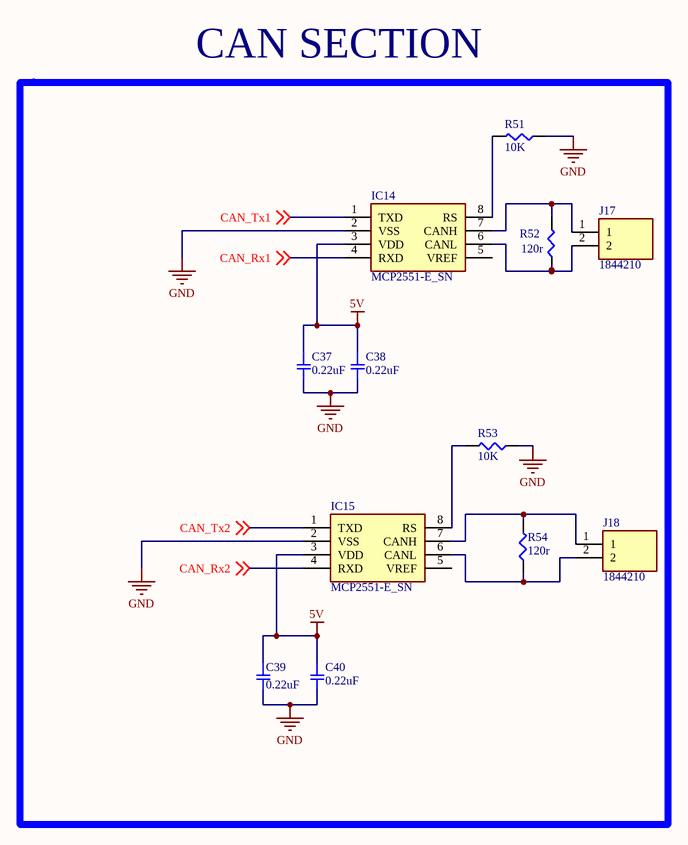
[diagram p14: CAN.SchDoc]

### Parts
C37  0.22uF  [SMD-0805C]
C38  0.22uF  [SMD-0805C]
C39  0.22uF  [SMD-0805C]
C40  0.22uF  [SMD-0805C]
IC14  MCP2551-E_SN  [SOIC127P600X175-8N]
IC15  MCP2551-E_SN  [SOIC127P600X175-8N]
J17  1844210  [SHDRRA2W80P0X350_1X2_840X920X825P]
J18  1844210  [SHDRRA2W80P0X350_1X2_840X920X825P]
R51  10K  [SMD-0805-RES]
R52  120r  [SMD-0805-RES]
R53  10K  [SMD-0805-RES]
R54  120r  [SMD-0805-RES]

### Blocks framed on the sheet
CAN SECTION: C37-C40 IC14 IC15 J17 J18 R51-R54

### Nets
5V: C37.1 C38.1 C39.1 C40.1 IC14.3(VDD) IC15.3(VDD)
GND: C37.2 C38.2 C39.2 C40.2 IC14.2(VSS) IC15.2(VSS) R51.1 R53.1
CAN_Rx1: IC14.4(RXD) ; off-sheet CAN_Rx1
CAN_Rx2: IC15.4(RXD) ; off-sheet CAN_Rx2
CAN_Tx1: IC14.1(TXD) ; off-sheet CAN_Tx1
CAN_Tx2: IC15.1(TXD) ; off-sheet CAN_Tx2
NetIC14_6: IC14.6(CANL) J17.2 R52.1
NetIC14_7: IC14.7(CANH) J17.1 R52.2
NetIC14_8: IC14.8(RS) R51.2
NetIC15_6: IC15.6(CANL) J18.2 R54.1
NetIC15_7: IC15.7(CANH) J18.1 R54.2
NetIC15_8: IC15.8(RS) R53.2

Not connected (* = marked no-connect by the designer): IC14 5(VREF); IC15 5(VREF)

### Library data of the parts
C37-C40 = GCD21BR71H104KA01L: as C21 on sheet Usb to Uart; Datasheets: http://www.murata.com/~/media/webrenewal/support/library/catalog/products/capacitor/mlcc/c03e.ashx; Image: //media.digikey.com/Renders/Murata%20Renders/0805%28GxM6%29.jpg; Digi-Key Part Number: 490-11955-1-ND; Part Number: GCD21BR71H104KA01L; Quantity Available: 157; @ qty: 0; Packaging: Cut Tape (CT); Series: GCD; Part Status: Active; Voltage: 50V; Temperature Coefficient: X7R; Operating Temperature: -55°C ~ 125°C; Features: -; Ratings: AEC-Q200; Applications: Automotive; Mounting Type: Surface Mount, MLCC; Package / Case: 0805 (2012 Metric); Size / Dimension: 0.079" L x 0.049" W (2.00mm x 1.25mm); Height - Seated (Max): -; Thickness (Max): 0.049" (1.25mm); Lead Spacing: -; Lead Style: -
IC14 IC15 = MCP2551-E_SN: Integrated Circuit; Manufacturer_Name: Microchip; Manufacturer_Part_Number: MCP2551-E/SN; Datasheet Link: https://datasheet.datasheetarchive.com/originals/distributors/SFDatasheet-4/sf-00090061.pdf; Height: 1.75mm; Mouser Part Number: 579-MCP2551-E/SN; Mouser Price/Stock: https://www.mouser.co.uk/ProductDetail/Microchip-Technology/MCP2551-E-SN?qs=Vn0zuzr35GHkGDCgnw0F9A%3D%3D; Arrow Part Number: MCP2551-E/SN; Arrow Price/Stock: https://www.arrow.com/en/products/mcp2551-esn/microchip-technology
J17 J18 = 1844210: Connector; Manufacturer_Name: Phoenix Contact; Datasheet Link: http://www.phoenixcontact.com/gb/produkte/1844210; Height: 8.25mm; Manufacturer_Part_Number: 1844210; Mouser Part Number: 651-1844210; Mouser Price/Stock: https://www.mouser.co.uk/ProductDetail/Phoenix-Contact/1844210?qs=8BCRtFWWXORb3OQRdxIGVQ%3D%3D; Arrow Part Number: 1844210; Arrow Price/Stock: https://www.arrow.com/en/products/1844210/phoenix-contact?region=nac
R51-R54 = ERJ-6ENF1001V: as R37 on sheet Usb to Uart; Part Number: ERJ-6ENF1001V; Datasheets: http://industrial.panasonic.com/www-cgi/jvcr13pz.cgi?E+PZ+3+AOA0002+ERJ6ENF1001V+7+WW; Image: //media.digikey.com/Renders/Panasonic%20Renders/ERJ-0805%20Pkg.jpg; Digi-Key Part Number: P1.00KCCT-ND; Quantity Available: 12895103; Packaging: Cut Tape (CT); Series: ERJ; Part Status: Active; Value: 1k; Tolerance: ±1%; Composition: Thick Film; Features: Automotive AEC-Q200; Operating Temperature: -55°C ~ 155°C; Package / Case: 0805 (2012 Metric); Supplier Device Package: 0805; Size / Dimension: 0.079" L x 0.049" W (2.00mm x 1.25mm); Height - Seated (Max): 0.028" (0.70mm); Number of Terminations: 2; Failure Rate: -

## Sheet DIGITAL POT.SchDoc
size A; SheetNumber: 17; SheetTotal: 24
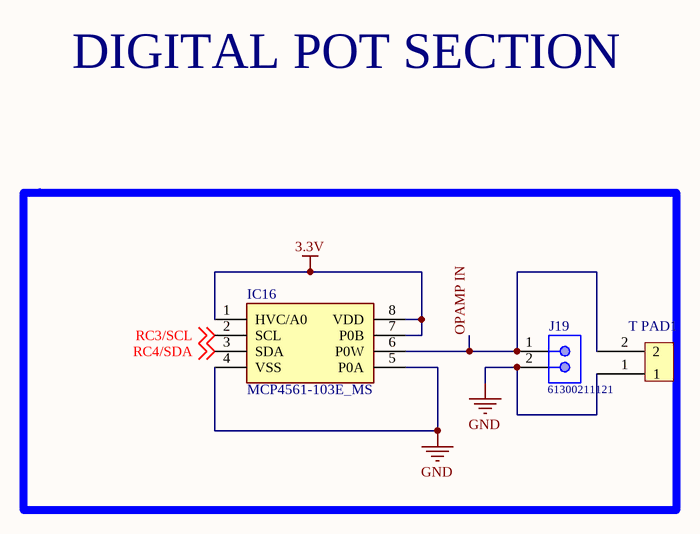
[diagram p15: DIGITAL POT.SchDoc]

### Parts
IC16  MCP4561-103E_MS  [SOP65P490X110-8N]
J19  61300211121  [61300211121]
T_PAD1  pad  [pad]  (value not drawn)

### Nets
3.3V: IC16.1(HVC/A0) IC16.7(P0B) IC16.8(VDD)
GND: IC16.4(VSS) IC16.5(P0A) J19.2 T_PAD1.1
OPAMP IN: IC16.6(P0W) J19.1 T_PAD1.2
RC3/SCL: IC16.2(SCL) ; off-sheet RC3/SCL
RC4/SDA: IC16.3(SDA) ; off-sheet RC4/SDA

### Notes on the sheet
- DIGITAL POT SECTION

### Library data of the parts
IC16 = MCP4561-103E_MS: Integrated Circuit; Manufacturer_Name: Microchip; Manufacturer_Part_Number: MCP4561-103E/MS; Datasheet Link: http://ww1.microchip.com/downloads/en/DeviceDoc/22107B.pdf; Height: 1.1mm; Mouser Part Number: 579-MCP4561-103E/MS; Mouser Price/Stock: https://www.mouser.co.uk/ProductDetail/Microchip-Technology/MCP4561-103E-MS?qs=hH%252BOa0VZEiBcchYhgnCL5Q%3D%3D; Arrow Part Number: MCP4561-103E/MS; Arrow Price/Stock: https://www.arrow.com/en/products/mcp4561-103ems/microchip-technology?region=nac
J19 = 61300211121: as J13 on sheet DAC SPI; ComponentLink1Description: Manufacturer; ComponentLink1URL: http://www.we-online.de; ComponentLink2Description: Datasheet; ComponentLink2URL: https://katalog.we-online.de/em/datasheet/6130xx11121.pdf; Part Number: 61300211121; Published Date: June 2019; Publisher: Wurth Elektronik; Pitch: 2.54mm; Operating Temperature: -40 to +105degC; Mounting Technology: THT; Packaging: Bag; Row Number: Single; Orientation: Vertical

## Sheet Rotary Encoder.SchDoc
size OrCAD A; SheetNumber: 17; SheetTotal: 22
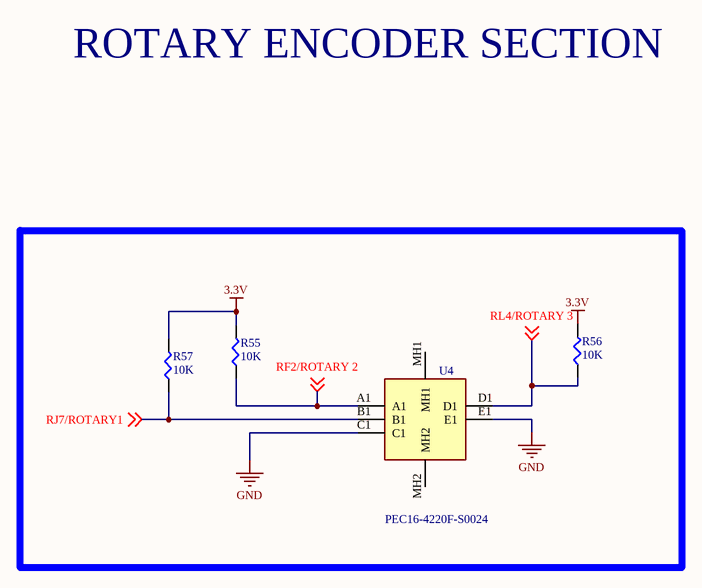
[diagram p16: Rotary Encoder.SchDoc]

### Parts
R55  10K  [SMD-0805-RES]
R56  10K  [SMD-0805-RES]
R57  10K  [SMD-0805-RES]
U4  PEC16-4220F-S0024  [PEC164120FS0012]

### Nets
3.3V: R55.2 R56.2 R57.2
GND: U4.C1 U4.E1
RF2/ROTARY 2: R55.1 U4.A1 ; off-sheet RF2/ROTARY 2
RJ7/ROTARY1: R57.1 U4.B1 ; off-sheet RJ7/ROTARY1
RL4/ROTARY 3: R56.1 U4.D1 ; off-sheet RL4/ROTARY 3

Not connected (* = marked no-connect by the designer): U4 MH1 MH2

### Notes on the sheet
- ROTARY ENCODER SECTION

### Library data of the parts
R55-R57 = ERJ-6ENF1001V: as R37 on sheet Usb to Uart; Part Number: ERJ-6ENF1001V; Datasheets: http://industrial.panasonic.com/www-cgi/jvcr13pz.cgi?E+PZ+3+AOA0002+ERJ6ENF1001V+7+WW; Image: //media.digikey.com/Renders/Panasonic%20Renders/ERJ-0805%20Pkg.jpg; Digi-Key Part Number: P1.00KCCT-ND; Quantity Available: 12895103; Packaging: Cut Tape (CT); Series: ERJ; Part Status: Active; Value: 1k; Tolerance: ±1%; Composition: Thick Film; Features: Automotive AEC-Q200; Operating Temperature: -55°C ~ 155°C; Package / Case: 0805 (2012 Metric); Supplier Device Package: 0805; Size / Dimension: 0.079" L x 0.049" W (2.00mm x 1.25mm); Height - Seated (Max): 0.028" (0.70mm); Number of Terminations: 2; Failure Rate: -
U4 = PEC16-4220F-S0024: Undefined or Miscellaneous; Manufacturer_Name: Bourns; Datasheet Link: https://www.bourns.com/pdfs/PEC16.pdf; Height: 28mm; Manufacturer_Part_Number: PEC16-4220F-S0024; Mouser Part Number: 652-PEC16-4220FS0024; Mouser Price/Stock: https://www.mouser.co.uk/ProductDetail/Bourns/PEC16-4220F-S0024?qs=6FD5PBp7ZtQte%252Bg7b%2FiMUw%3D%3D; Arrow Part Number: PEC16-4220F-S0024; Arrow Price/Stock: https://www.arrow.com/en/products/pec16-4220f-s0024/bourns

## Sheet USB.SchDoc
size Letter; SheetNumber: 18; SheetTotal: 22
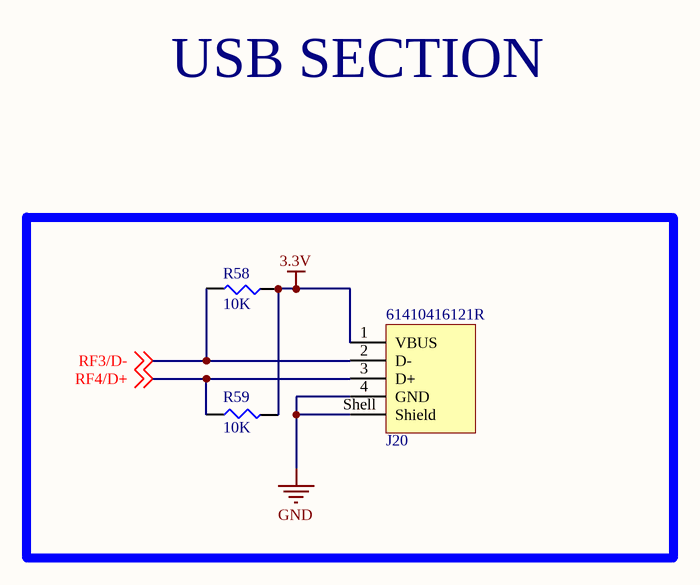
[diagram p17: USB.SchDoc]

### Parts
J20  61410416121R  [61410416121R]
R58  10K  [SMD-0805-RES]
R59  10K  [SMD-0805-RES]

### Nets
3.3V: J20.1(VBUS) R58.1 R59.2
GND: J20.4(GND) J20.Shell(Shield)
RF3/D-: J20.2(D-) R58.2 ; off-sheet RF3/D-
RF4/D+: J20.3(D+) R59.1 ; off-sheet RF4/D+

### Notes on the sheet
- USB SECTION

### Library data of the parts
J20 = 61410416121R: WR-COM USB 2.0 Type B Horizontal THR; Manufacturer: Wurth Elektronik; Match Code: WR-USB; Gender: Receptacle; Interface Type: Type B; Number of Ports: 1; Rated Current: 1.5A; Working Voltage: 30V (AC); Manufacturer Part Number: 61410416121R; Category: Input/Output Connectors; ComponentLink1Description: Website Link; ComponentLink1URL: https://www.we-online.com/redexpert/article/61410416121R?ad; ComponentLink2Description: Datasheet Link; ComponentLink2URL: https://www.we-online.com/redexpert/spec/61410416121R?ad; Mount: Surface Mount; Operating Temperature Max: 85°C; Operating Temperature Min: -55°C; Packaging: Tape and Reel; Application: USB 2.0; Number of Pins: 4; Orientation: Horizontal
R58 R59 = ERJ-6ENF1001V: as R37 on sheet Usb to Uart; Part Number: ERJ-6ENF1001V; Datasheets: http://industrial.panasonic.com/www-cgi/jvcr13pz.cgi?E+PZ+3+AOA0002+ERJ6ENF1001V+7+WW; Image: //media.digikey.com/Renders/Panasonic%20Renders/ERJ-0805%20Pkg.jpg; Digi-Key Part Number: P1.00KCCT-ND; Quantity Available: 12895103; Packaging: Cut Tape (CT); Series: ERJ; Part Status: Active; Value: 1k; Tolerance: ±1%; Composition: Thick Film; Features: Automotive AEC-Q200; Operating Temperature: -55°C ~ 155°C; Package / Case: 0805 (2012 Metric); Supplier Device Package: 0805; Size / Dimension: 0.079" L x 0.049" W (2.00mm x 1.25mm); Height - Seated (Max): 0.028" (0.70mm); Number of Terminations: 2; Failure Rate: -

## Sheet ACCELEROMETER.SchDoc
size OrCAD A; SheetNumber: 19; SheetTotal: 22
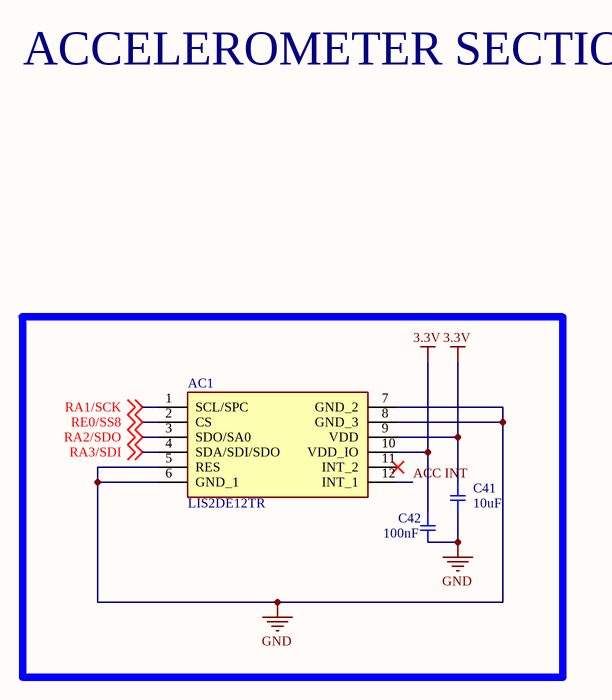
[diagram p18: ACCELEROMETER.SchDoc]

### Parts
AC1  LIS2DE12TR  [LIS2DE12TR]
C41  10uF  [SMD-0805C]
C42  100nF  [SMD-0805C]

### Nets
3.3V: AC1.9(VDD) AC1.10(VDD_IO) C41.1 C42.1
GND: AC1.5(RES) AC1.6(GND_1) AC1.7(GND_2) AC1.8(GND_3) C41.2 C42.2
ACC INT: AC1.12(INT_1)
RA1/SCK: AC1.1(SCL/SPC) ; off-sheet RA1/SCK
RA2/SDO: AC1.3(SDO/SA0) ; off-sheet RA2/SDO
RA3/SDI: AC1.4(SDA/SDI/SDO) ; off-sheet RA3/SDI
RE0/SS8: AC1.2(CS) ; off-sheet RE0/SS8

Not connected (* = marked no-connect by the designer): AC1 11(INT_2)*

### Notes on the sheet
- ACCELEROMETER SECTION

### Library data of the parts
AC1 = LIS2DE12TR: Accelerometer; Manufacturer_Name: STMicroelectronics; Datasheet Link: https://www.mouser.co.uk/datasheet/2/389/dm00153214-1798409.pdf; Height: 1mm; Manufacturer_Part_Number: LIS2DE12TR; Mouser Part Number: 511-LIS2DE12TR; Mouser Price/Stock: https://www.mouser.co.uk/ProductDetail/STMicroelectronics/LIS2DE12TR?qs=e%2Fel81Nv5iw4m6D8fXXMWA%3D%3D; Arrow Part Number: LIS2DE12TR; Arrow Price/Stock: https://www.arrow.com/en/products/lis2de12tr/stmicroelectronics
C41 C42 = GCD21BR71H104KA01L: as C21 on sheet Usb to Uart; Datasheets: http://www.murata.com/~/media/webrenewal/support/library/catalog/products/capacitor/mlcc/c03e.ashx; Image: //media.digikey.com/Renders/Murata%20Renders/0805%28GxM6%29.jpg; Digi-Key Part Number: 490-11955-1-ND; Part Number: GCD21BR71H104KA01L; Quantity Available: 157; @ qty: 0; Packaging: Cut Tape (CT); Series: GCD; Part Status: Active; Voltage: 50V; Temperature Coefficient: X7R; Operating Temperature: -55°C ~ 125°C; Features: -; Ratings: AEC-Q200; Applications: Automotive; Mounting Type: Surface Mount, MLCC; Package / Case: 0805 (2012 Metric); Size / Dimension: 0.079" L x 0.049" W (2.00mm x 1.25mm); Height - Seated (Max): -; Thickness (Max): 0.049" (1.25mm); Lead Spacing: -; Lead Style: -

## Sheet Current SENSOR.SchDoc
size Letter; SheetNumber: 20; SheetTotal: 22
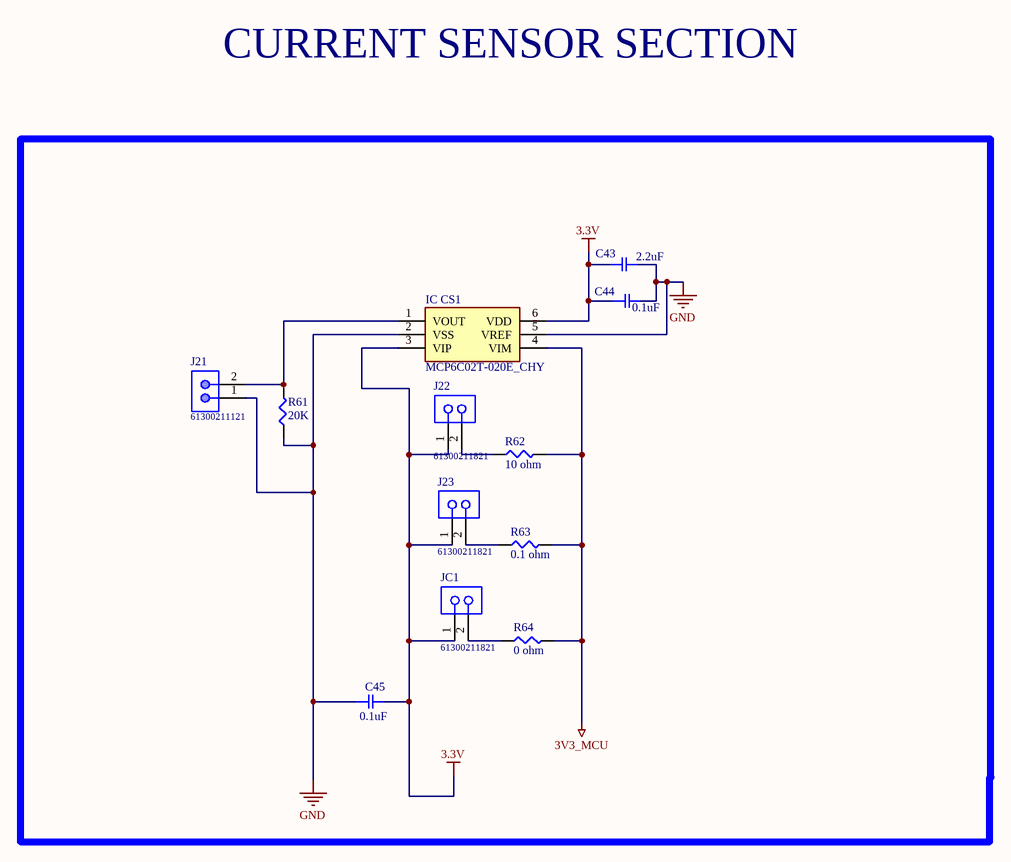
[diagram p19: Current SENSOR.SchDoc]

### Parts
C43  2.2uF  [SMD-0805C]
C44  0.1uF  [SMD-0805C]
C45  0.1uF  [SMD-0805C]
IC_CS1  MCP6C02T-020E_CHY  [SOT95P280X145-6N]
J21  61300211121  [61300211121]
J22  61300211821  [61300211821]
J23  61300211821  [61300211821]
JC1  61300211821  [61300211821]
R61  20K  [SMD-0805-RES]
R62  10 ohm  [SMD-1206-RES]
R63  0.1 ohm  [SMD-0805-RES]
R64  0 ohm  [SMD-1206-RES]

### Nets
3.3V: C43.1 C44.1 C45.2 IC_CS1.3(VIP) IC_CS1.6(VDD) J22.1 J23.1 JC1.1
3V3_MCU: IC_CS1.4(VIM) R62.2 R63.2 R64.2
GND: C43.2 C44.2 C45.1 IC_CS1.2(VSS) IC_CS1.5(VREF) J21.1 R61.1
NetIC_CS1_1: IC_CS1.1(VOUT) J21.2 R61.2
NetJ22_2: J22.2 R62.1
NetJ23_2: J23.2 R63.1
NetJC1_2: JC1.2 R64.1

### Notes on the sheet
- CURRENT SENSOR SECTION

### Library data of the parts
C43-C45 = GCD21BR71H104KA01L: as C21 on sheet Usb to Uart; Datasheets: http://www.murata.com/~/media/webrenewal/support/library/catalog/products/capacitor/mlcc/c03e.ashx; Image: //media.digikey.com/Renders/Murata%20Renders/0805%28GxM6%29.jpg; Digi-Key Part Number: 490-11955-1-ND; Part Number: GCD21BR71H104KA01L; Quantity Available: 157; @ qty: 0; Packaging: Cut Tape (CT); Series: GCD; Part Status: Active; Voltage: 50V; Temperature Coefficient: X7R; Operating Temperature: -55°C ~ 125°C; Features: -; Ratings: AEC-Q200; Applications: Automotive; Mounting Type: Surface Mount, MLCC; Package / Case: 0805 (2012 Metric); Size / Dimension: 0.079" L x 0.049" W (2.00mm x 1.25mm); Height - Seated (Max): -; Thickness (Max): 0.049" (1.25mm); Lead Spacing: -; Lead Style: -
IC_CS1 = MCP6C02T-020E_CHY: Integrated Circuit; Manufacturer_Name: Microchip; Manufacturer_Part_Number: MCP6C02T-020E/CHY; Datasheet Link: https://www.arrow.com/en/products/mcp6c02t-020echy/microchip-technology; Height: 1.45mm; Mouser Part Number: 579-MCP6C02T020ECHY; Mouser Price/Stock: https://www.mouser.co.uk/ProductDetail/Microchip-Technology/MCP6C02T-020E-CHY?qs=PqoDHHvF64%2FP1agGSWWLsQ%3D%3D; Arrow Part Number: MCP6C02T-020E/CHY; Arrow Price/Stock: https://www.arrow.com/en/products/mcp6c02t-020echy/microchip-technology?region=nac
J21 = 61300211121: as J13 on sheet DAC SPI; ComponentLink1Description: Manufacturer; ComponentLink1URL: http://www.we-online.de; ComponentLink2Description: Datasheet; ComponentLink2URL: https://katalog.we-online.de/em/datasheet/6130xx11121.pdf; Part Number: 61300211121; Published Date: June 2019; Publisher: Wurth Elektronik; Pitch: 2.54mm; Operating Temperature: -40 to +105degC; Mounting Technology: THT; Packaging: Bag; Row Number: Single; Orientation: Vertical
J22 J23 JC1 = 61300211821: WR-PHD Socket Header, THT, pitch 2.54mm, Single Row, Vertical, 2pin; Pin Number: 2; Gender: Female; Rated Current: 3A; Working Voltage: 250VAC; Withstanding Voltage: 500VAC; Contact Resistance: 20mOhm; ComponentLink1Description: Manufacturer; ComponentLink1URL: http://www.we-online.de; ComponentLink2Description: Datasheet; ComponentLink2URL: https://katalog.we-online.de/em/datasheet/6130xx11821.pdf; Part Number: 61300211821; Published Date: June 2019; Publisher: Wurth Elektronik; Pitch: 2.54mm; Operating Temperature: -40 to +125degC; Mounting Technology: THT; Packaging: Tray; Row Number: Single; Orientation: Vertical
R61 = ERJ-P6WJ105V: RES SMD 1M OHM 5% 1/2W 0805; Manufacturer: Panasonic Electronic Components; Factory Stock: 0; Unit Price (USD): 0.08237; @ qty: 1500; Minimum Quantity: 1; Power (Watts): 0.5W, 1/2W; Temperature Coefficient: ±200ppm/°C; Part Number: ERJ-P6WJ105V; Datasheets: https://industrial.panasonic.com/cdbs/www-data/pdf/RDA0000/AOA0000C243.pdf; Image: //media.digikey.com/Renders/Panasonic%20Renders/ERJ-0805%20Pkg.jpg; Digi-Key Part Number: P16990CT-ND; Quantity Available: 3210; Packaging: Cut Tape (CT); Series: ERJ; Part Status: Active; Value: 1M; Tolerance: ±5%; Composition: Thick Film; Features: Automotive AEC-Q200, Pulse Withstanding; Operating Temperature: -55°C ~ 155°C; Package / Case: 0805 (2012 Metric); Supplier Device Package: 0805; Size / Dimension: 0.079" L x 0.049" W (2.00mm x 1.25mm); Height - Seated (Max): 0.030" (0.75mm); Number of Terminations: 2; Failure Rate: -
R62 R64 = ERJ-8BQFR22V: RES SMD 0.22 OHM 1% 1/2W 1206; Manufacturer: Panasonic Electronic Components; Factory Stock: 0; Unit Price (USD): 0.05778; @ qty: 1500; Minimum Quantity: 1; Value: 0.22; Power (Watts): 0.5W, 1/2W; Temperature Coefficient: ±250ppm/°C; Part Number: ERJ-8BQFR22V; Datasheets: https://industrial.panasonic.com/cdbs/www-data/pdf/RDA0000/AOA0000C239.pdf; Image: //media.digikey.com/Renders/Panasonic%20Renders/ERJ-1206%20Pkg.jpg; Digi-Key Part Number: P17624CT-ND; Quantity Available: 11511; Packaging: Cut Tape (CT); Series: ERJ; Part Status: Active; Tolerance: ±1%; Composition: Thick Film; Features: Automotive AEC-Q200, Current Sense; Operating Temperature: -55°C ~ 125°C; Package / Case: 1206 (3216 Metric); Supplier Device Package: 1206; Size / Dimension: 0.126" L x 0.063" W (3.20mm x 1.60mm); Height - Seated (Max): 0.028" (0.70mm); Number of Terminations: 2; Failure Rate: -
R63 = ERJ-S6SJR10V: RES SMD 0.1 OHM 5% 1/4W 0805; Manufacturer: Panasonic Electronic Components; Factory Stock: 0; Unit Price (USD): 0.07603; @ qty: 1500; Minimum Quantity: 1; Value: 0.1; Power (Watts): 0.25W, 1/4W; Temperature Coefficient: ±150ppm/°C; Part Number: ERJ-S6SJR10V; Datasheets: https://industrial.panasonic.com/cdbs/www-data/pdf/RDA0000/AOA0000CE5.pdf; Image: //media.digikey.com/Renders/Panasonic%20Renders/ERJ-0805%20Pkg.jpg; Digi-Key Part Number: P.1BKCT-ND; Quantity Available: 10102; Packaging: Cut Tape (CT); Series: ERJ; Part Status: Active; Tolerance: ±5%; Composition: Thick Film; Features: Anti-Sulfur, Automotive AEC-Q200; Operating Temperature: -55°C ~ 155°C; Package / Case: 0805 (2012 Metric); Supplier Device Package: 0805; Size / Dimension: 0.079" L x 0.049" W (2.00mm x 1.25mm); Height - Seated (Max): 0.026" (0.65mm); Number of Terminations: 2; Failure Rate: -

## Sheet OPAMP.SchDoc
size A4; SheetNumber: 21; SheetTotal: 22
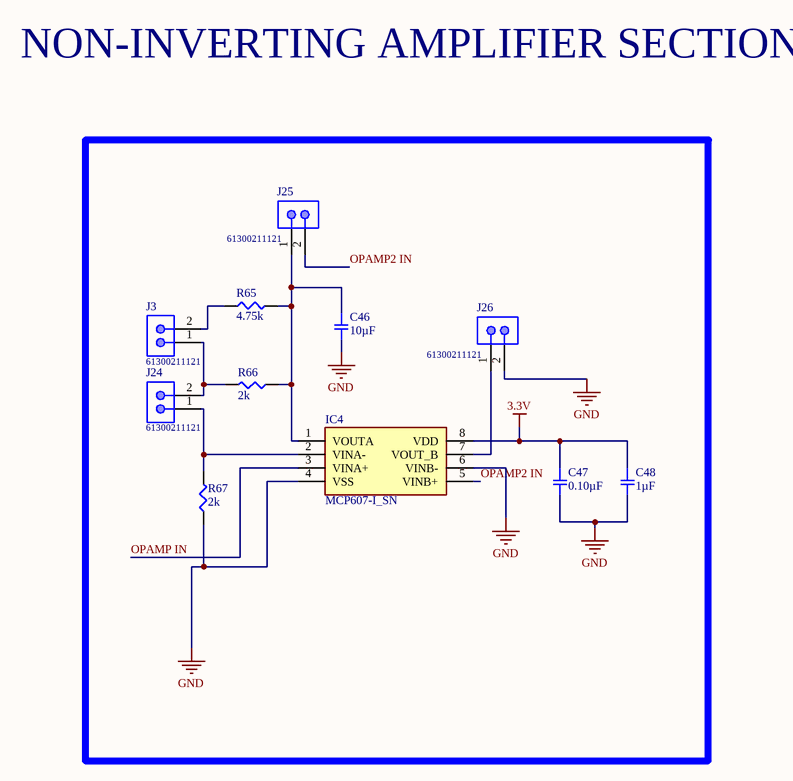
[diagram p20: OPAMP.SchDoc]

### Parts
C46  10µF  [SMD-0805C]
C47  0.10µF  [SMD-0805C]
C48  1µF  [SMD-0805C]
IC4  MCP607-I_SN  [SOIC127P600X175-8N]
J3  61300211121  [61300211121]
J24  61300211121  [61300211121]
J25  61300211121  [61300211121]
J26  61300211121  [61300211121]
R65  4.75k  [SMD-0805-RES]
R66  2k  [SMD-0805-RES]
R67  2k  [SMD-0805-RES]

### Nets
3.3V: C47.1 C48.1 IC4.8(VDD)
GND: C46.2 C47.2 C48.2 IC4.4(VSS) IC4.6(VINB-) J26.2 R67.1
OPAMP2 IN: IC4.5(VINB+) J25.2
OPAMP IN: IC4.3(VINA+)
NetC46_1: C46.1 IC4.1(VOUTA) J25.1 R65.2 R66.1
NetIC4_2: IC4.2(VINA-) J24.1 R67.2
NetIC4_7: IC4.7(VOUT_B) J26.1
NetJ3_1: J3.1 J24.2 R66.2
NetJ3_2: J3.2 R65.1

### Notes on the sheet
- NON-INVERTING AMPLIFIER SECTION

### Library data of the parts
C46 = GCJ21BR71A106KE01L: CAP CER 10UF 10V X7R 0805; Manufacturer: Murata Electronics North America; Factory Stock: 0; Unit Price (USD): 0.56; Minimum Quantity: 1; Tolerance: ±10%; Datasheets: http://www.murata.com/~/media/webrenewal/support/library/catalog/products/capacitor/mlcc/c03e.ashx; Image: //media.digikey.com/Renders/Murata%20Renders/0805%20(2012%20Metric)%20.85mm.jpg; Digi-Key Part Number: 490-12646-1-ND; Part Number: GCJ21BR71A106KE01L; Quantity Available: 2702; @ qty: 0; Packaging: Cut Tape (CT); Series: GCJ; Part Status: Active; Value: 10µF; Voltage: 10V; Temperature Coefficient: X7R; Operating Temperature: -55°C ~ 125°C; Features: Soft Termination; Ratings: AEC-Q200; Applications: Automotive, Boardflex Sensitive; Mounting Type: Surface Mount, MLCC; Package / Case: 0805 (2012 Metric); Size / Dimension: 0.079" L x 0.049" W (2.00mm x 1.25mm); Height - Seated (Max): -; Thickness (Max): 0.057" (1.45mm); Lead Spacing: -; Lead Style: -
C47 = GCD21BR71H104KA01L: as C33 on sheet Lan; Datasheets: http://www.murata.com/~/media/webrenewal/support/library/catalog/products/capacitor/mlcc/c03e.ashx; Image: //media.digikey.com/Renders/Murata%20Renders/0805%28GxM6%29.jpg; Digi-Key Part Number: 490-11955-1-ND; Part Number: GCD21BR71H104KA01L; Quantity Available: 157; @ qty: 0; Packaging: Cut Tape (CT); Series: GCD; Part Status: Active; Value: 0.10µF; Voltage: 50V; Temperature Coefficient: X7R; Operating Temperature: -55°C ~ 125°C; Features: -; Ratings: AEC-Q200; Applications: Automotive; Mounting Type: Surface Mount, MLCC; Package / Case: 0805 (2012 Metric); Size / Dimension: 0.079" L x 0.049" W (2.00mm x 1.25mm); Height - Seated (Max): -; Thickness (Max): 0.049" (1.25mm); Lead Spacing: -; Lead Style: -
C48 = GCJ219R71C105KA01D: CAP CER 1UF 16V X7R 0805; Manufacturer: Murata Electronics North America; Factory Stock: 0; Unit Price (USD): 0.29; Minimum Quantity: 1; Tolerance: ±10%; Datasheets: http://www.murata.com/~/media/webrenewal/support/library/catalog/products/capacitor/mlcc/c03e.ashx; Image: //media.digikey.com/Renders/Murata%20Renders/0805%20(2012%20Metric)%20.85mm.jpg; Digi-Key Part Number: 490-5800-1-ND; Part Number: GCJ219R71C105KA01D; Quantity Available: 140338; @ qty: 0; Packaging: Cut Tape (CT); Series: GCJ; Part Status: Active; Value: 1µF; Voltage: 16V; Temperature Coefficient: X7R; Operating Temperature: -55°C ~ 125°C; Features: Soft Termination; Ratings: AEC-Q200; Applications: Automotive, Boardflex Sensitive; Mounting Type: Surface Mount, MLCC; Package / Case: 0805 (2012 Metric); Size / Dimension: 0.079" L x 0.049" W (2.00mm x 1.25mm); Height - Seated (Max): -; Thickness (Max): 0.037" (0.95mm); Lead Spacing: -; Lead Style: -
IC4 = MCP607-I_SN: Integrated Circuit; Manufacturer_Name: Microchip; Manufacturer_Part_Number: MCP607-I/SN; Datasheet Link: http://ww1.microchip.com/downloads/en/DeviceDoc/11177f.pdf; Height: 1.75mm; Mouser Part Number: 579-MCP607-I/SN; Mouser Price/Stock: https://www.mouser.co.uk/ProductDetail/Microchip-Technology/MCP607-I-SN/?qs=Ux5rHyN1IXQVM1mIseVI1A%3D%3D; Arrow Part Number: MCP607-I/SN; Arrow Price/Stock: https://www.arrow.com/en/products/mcp607-isn/microchip-technology?region=nac
J3 J24-J26 = 61300211121: as J13 on sheet DAC SPI; ComponentLink1Description: Manufacturer; ComponentLink1URL: http://www.we-online.de; ComponentLink2Description: Datasheet; ComponentLink2URL: https://katalog.we-online.de/em/datasheet/6130xx11121.pdf; Part Number: 61300211121; Published Date: June 2019; Publisher: Wurth Elektronik; Pitch: 2.54mm; Operating Temperature: -40 to +105degC; Mounting Technology: THT; Packaging: Bag; Row Number: Single; Orientation: Vertical
R65 = ERJ-6ENF4751V: RES SMD 4.75K OHM 1% 1/8W 0805; Manufacturer: Panasonic Electronic Components; Factory Stock: 0; Unit Price (USD): 0.00729; @ qty: 1500; Minimum Quantity: 1; Power (Watts): 0.125W, 1/8W; Temperature Coefficient: ±100ppm/°C; Part Number: ERJ-6ENF4751V; Datasheets: http://industrial.panasonic.com/www-cgi/jvcr13pz.cgi?E+PZ+3+AOA0002+ERJ6ENF4751V+7+WW; Image: //media.digikey.com/Renders/Panasonic%20Renders/ERJ-0805%20Pkg.jpg; Digi-Key Part Number: P4.75KCCT-ND; Quantity Available: 354774; Packaging: Cut Tape (CT); Series: ERJ; Part Status: Active; Value: 4.75k; Tolerance: ±1%; Composition: Thick Film; Features: Automotive AEC-Q200; Operating Temperature: -55°C ~ 155°C; Package / Case: 0805 (2012 Metric); Supplier Device Package: 0805; Size / Dimension: 0.079" L x 0.049" W (2.00mm x 1.25mm); Height - Seated (Max): 0.028" (0.70mm); Number of Terminations: 2; Failure Rate: -
R66 R67 = ERJ-P06D2001V: RES SMD 2K OHM 0.5% 1/2W 0805; Manufacturer: Panasonic Electronic Components; Factory Stock: 0; Unit Price (USD): 0.04514; @ qty: 1500; Minimum Quantity: 1; Power (Watts): 0.5W, 1/2W; Temperature Coefficient: ±100ppm/°C; Part Number: ERJ-P06D2001V; Datasheets: https://industrial.panasonic.com/cdbs/www-data/pdf/RDA0000/AOA0000C243.pdf; Image: //media.digikey.com/Renders/Panasonic%20Renders/ERJ-0805%20Pkg.jpg; Digi-Key Part Number: P16044CT-ND; Quantity Available: 25431; Packaging: Cut Tape (CT); Series: ERJ; Part Status: Active; Value: 2k; Tolerance: ±0.5%; Composition: Thick Film; Features: Automotive AEC-Q200, Pulse Withstanding; Operating Temperature: -55°C ~ 155°C; Package / Case: 0805 (2012 Metric); Supplier Device Package: 0805; Size / Dimension: 0.079" L x 0.049" W (2.00mm x 1.25mm); Height - Seated (Max): 0.028" (0.70mm); Number of Terminations: 2; Failure Rate: -